# Altium project PJ1301-001-A1.PrjPCB (part 1 of 2)
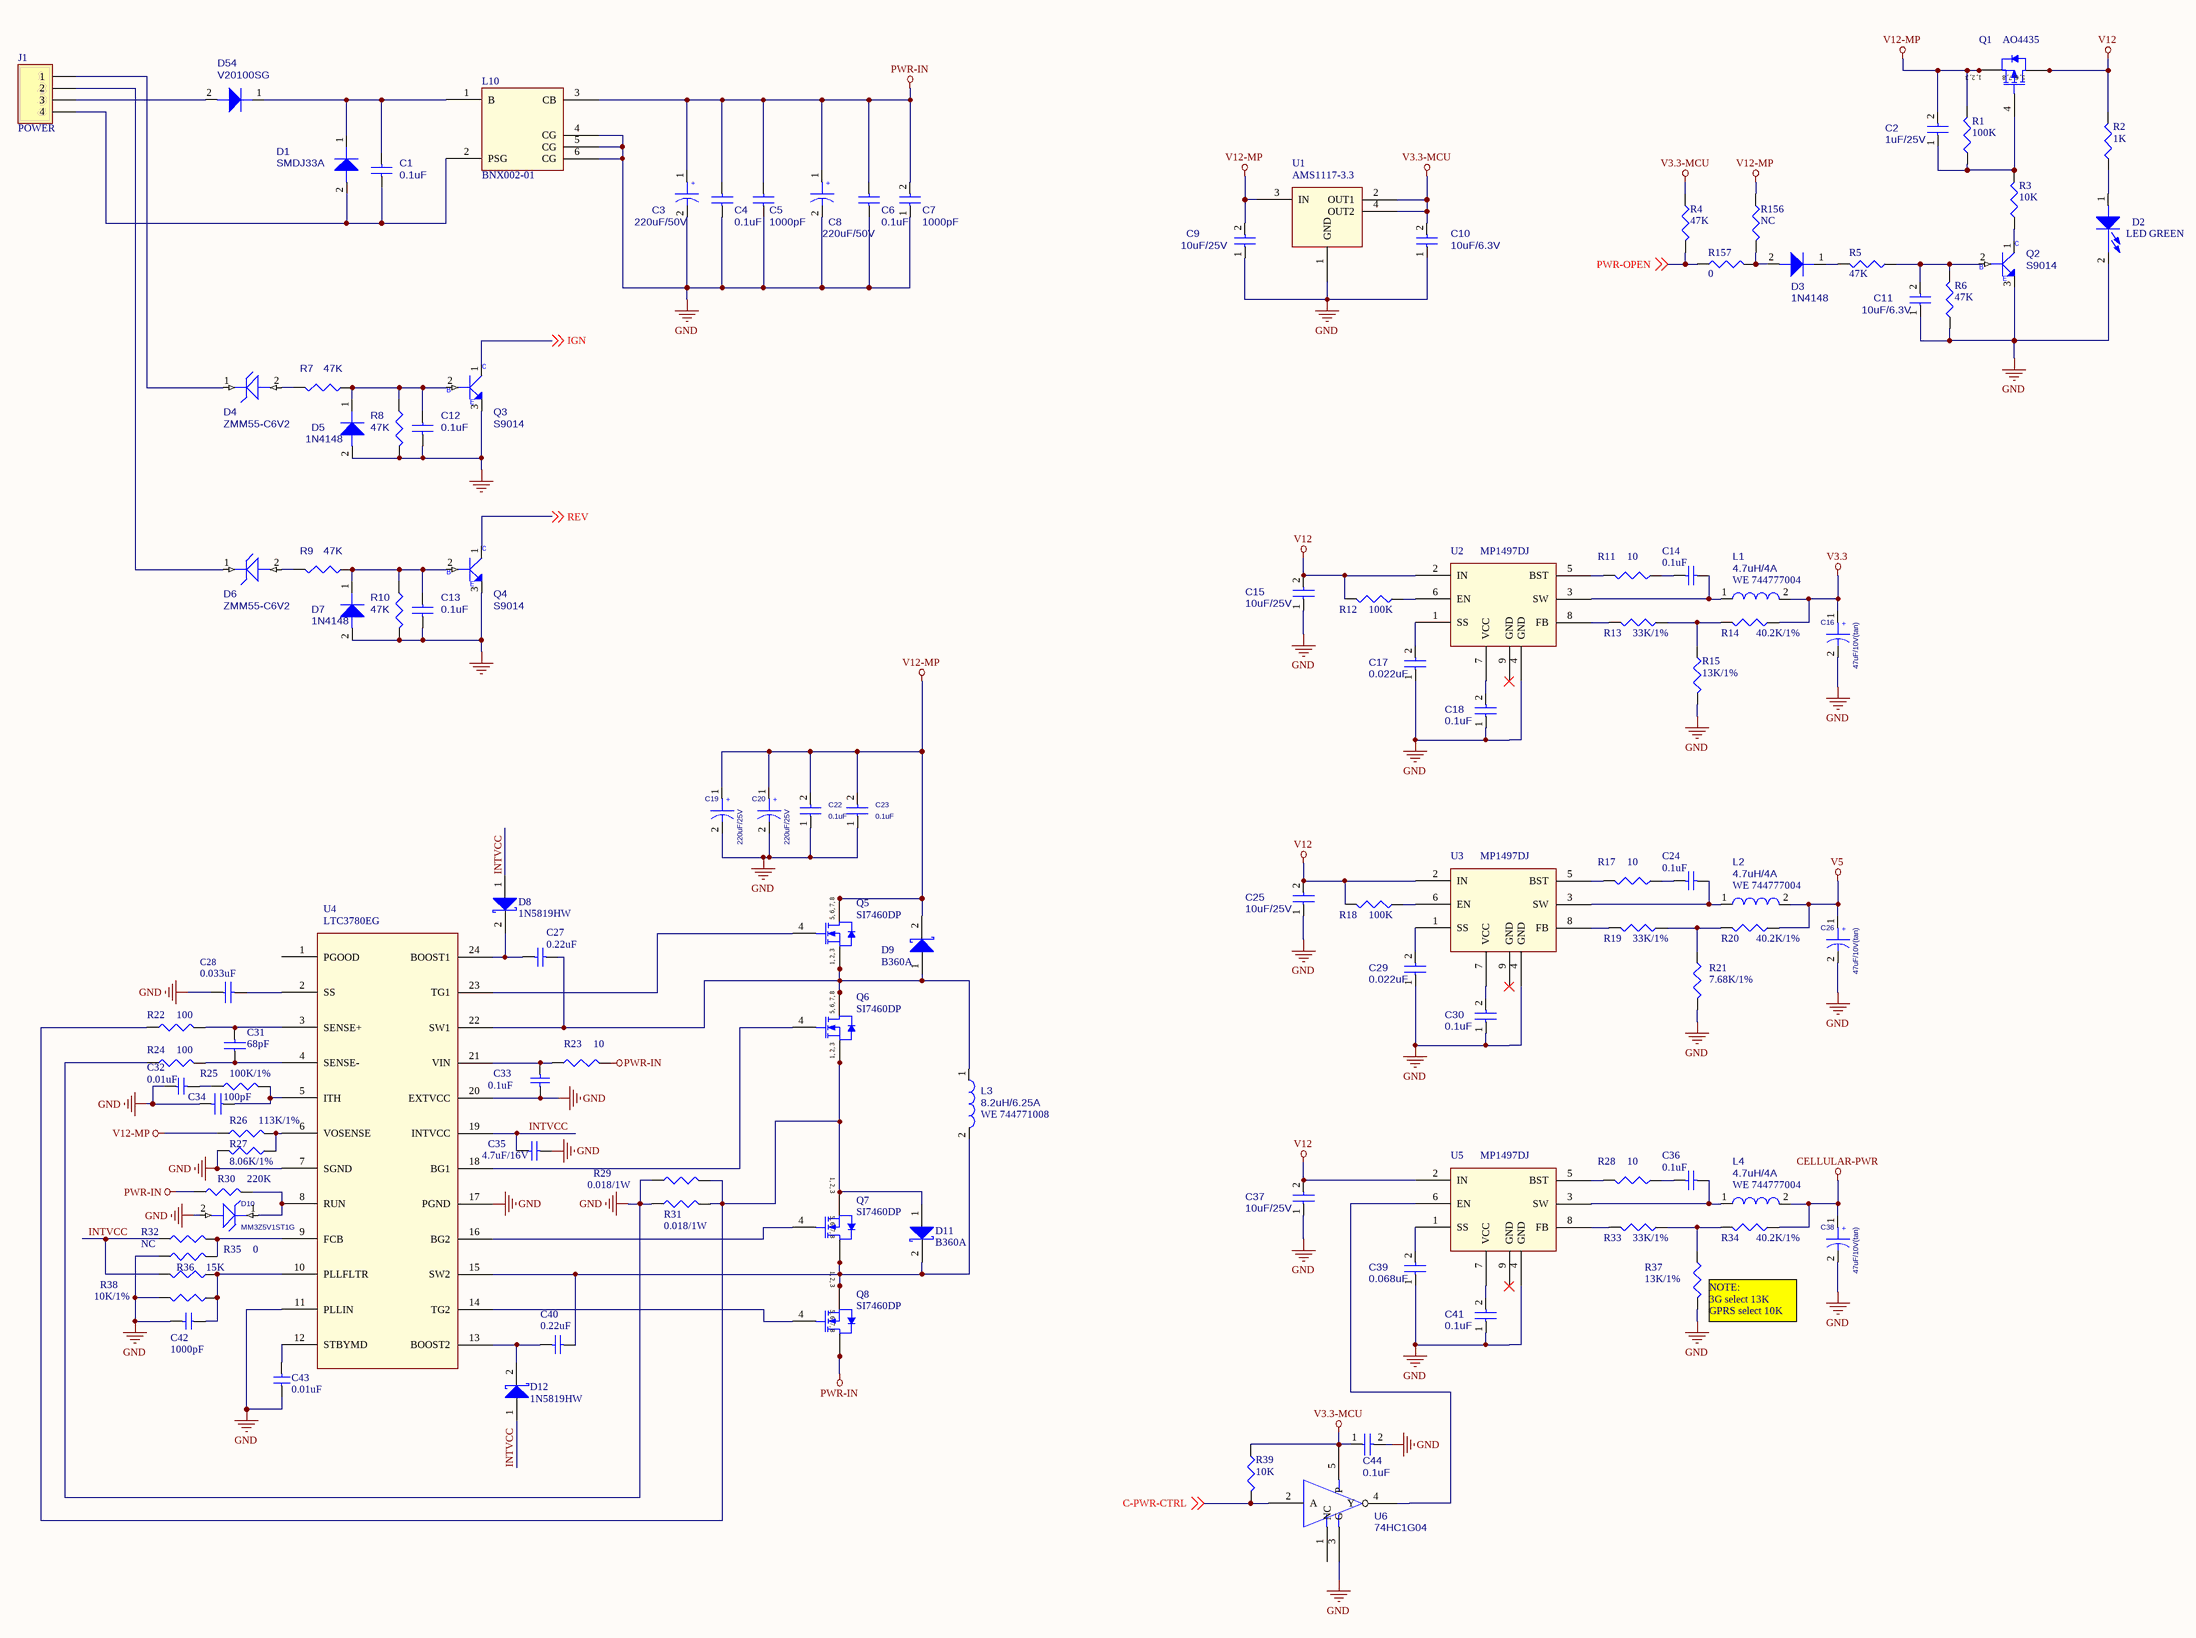
[diagram p0: [01]POWER.SchDoc]
12 sheets, 429 parts. Net scope: global (net labels, ports and power ports of the same name join across sheets).
Board file: PJ1301-001-A1.PcbDoc
Sheets:
  [01]POWER.SchDoc
  [02]MCU.SchDoc
  [03]CORE_BOARD.SchDoc
  [04]STORAGE.SchDoc
  [05]USB_HUB.SchDoc
  [06]EXT_UART.SchDoc
  [07]COMM_BOARD.SchDoc
  [08]CAN.SchDoc
  [09]SERIAL_PORT.SchDoc
  [10]MISC.SchDoc
  [11]VIDEO_PORT.SchDoc
  [12]IO_PORT.SchDoc

## Sheet [01]POWER.SchDoc
size C

### Parts
C1  0.1uF  [0603]
C2  1uF/25V  [0805]
C3  220uF/50V  [DL-10*10.5]
C4  0.1uF  [0603]
C5  1000pF  [0603]
C6  0.1uF  [0603]
C7  1000pF  [0603]
C8  220uF/50V  [DL-10*10.5]
C9  10uF/25V  [1812]
C10  10uF/6.3V  [0805]
C11  10uF/6.3V  [0805]
C12  0.1uF  [0603]
C13  0.1uF  [0603]
C14  0.1uF  [0603]
C15  10uF/25V  [1812]
C16  47uF/10V(tan)  [3528]
C17  0.022uF  [0603]
C18  0.1uF  [0603]
C19  220uF/25V  [DL-8*10.5]
C20  220uF/25V  [DL-8*10.5]
C22  0.1uF  [0603]
C23  0.1uF  [0603]
C24  0.1uF  [0603]
C25  10uF/25V  [1812]
C26  47uF/10V(tan)  [3528]
C27  0.22uF  [0603]
C28  0.033uF  [0603]
C29  0.022uF  [0603]
C30  0.1uF  [0603]
C31  68pF  [0603]
C32  0.01uF  [0603]
C33  0.1uF  [0603]
C34  100pF  [0603]
C35  4.7uF/16V  [0805]
C36  0.1uF  [0603]
C37  10uF/25V  [1812]
C38  47uF/10V(tan)  [3528]
C39  0.068uF  [0603]
C40  0.22uF  [0603]
C41  0.1uF  [0603]
C42  1000pF  [0603]
C43  0.01uF  [0603]
C44  0.1uF  [0603]
D1  SMDJ33A  [DO214AB]
D2  LED GREEN  [LED0603]
D3  1N4148  [MINI-MELF]
D4  ZMM55-C6V2  [MINI-MELF]
D5  1N4148  [MINI-MELF]
D6  ZMM55-C6V2  [MINI-MELF]
D7  1N4148  [MINI-MELF]
D8  1N5819HW  [1N5819]
D9  B360A  [B320A]
D10  MM3Z5V1ST1G  [MM3Z5V1ST1G]
D11  B360A  [B320A]
D12  1N5819HW  [1N5819]
D54  V20100SG  [V20100SG]
J1  POWER  [5557-4PIN]
L1  4.7uH/4A  code: WE 744777004  [IND-4.7UH-4A]
L2  4.7uH/4A  code: WE 744777004  [IND-4.7UH-4A]
L3  8.2uH/6.25A  code: WE 744771008  [IND-8.2UH-10A]
L4  4.7uH/4A  code: WE 744777004  [IND-4.7UH-4A]
L10  BNX002-01  [BNX002-001]
Q1  AO4435  [SO8]
Q2  S9014  [NPN]
Q3  S9014  [NPN]
Q4  S9014  [NPN]
Q5  SI7460DP  [POWERPAK]
Q6  SI7460DP  [POWERPAK]
Q7  SI7460DP  [POWERPAK]
Q8  SI7460DP  [POWERPAK]
R1  100K  [0603]
R2  1K  [0603]
R3  10K  [0603]
R4  47K  [0603]
R5  47K  [0603]
R6  47K  [0603]
R7  47K  [0603]
R8  47K  [0603]
R9  47K  [0603]
R10  47K  [0603]
R11  10  [0603]
R12  100K  [0603]
R13  33K/1%  [0603]
R14  40.2K/1%  [0603]
R15  13K/1%  [0603]
R17  10  [0603]
R18  100K  [0603]
R19  33K/1%  [0603]
R20  40.2K/1%  [0603]
R21  7.68K/1%  [0603]
R22  100  [0603]
R23  10  [0805]
R24  100  [0603]
R25  100K/1%  [0603]
R26  113K/1%  [0603]
R27  8.06K/1%  [0603]
R28  10  [0603]
R29  0.018/1W  [2512]
R30  220K  [0603]
R31  0.018/1W  [2512]
R32  NC  [0603]
R33  33K/1%  [0603]
R34  40.2K/1%  [0603]
R35  0  [0603]
R36  15K  [0603]
R37  13K/1%  [0603]
R38  10K/1%  [0603]
R39  10K  [0603]
R156  NC  [0603]
R157  0  [0603]
U1  AMS1117-3.3  [AMS1117]
U2  MP1497DJ  [TSOT23-8]
U3  MP1497DJ  [TSOT23-8]
U4  LTC3780EG  [LTC3780EG]
U5  MP1497DJ  [TSOT23-8]
U6  74HC1G04  [SOT753]

### Nets
CELLULAR-PWR: C38.1 L4.2 R34.1
GND: C3.2 C4.1 C5.1 C6.1 C7.1 C8.2 C9.1 C10.1 C11.1 C12.2 C13.2 C15.1 C16.2 C17.1 C18.1 C19.2 C20.2 C22.1 C23.1 C25.1 C26.2 C28.1 C29.1 C30.1 C32.1 C33.1 C34.2 C35.2 C37.1 C38.2 C39.1 C41.1 C42.2 C43.1 C44.2 D2.2(CATHODE) D5.2 D7.2 D10.2 L10.4(CG) L10.5(CG) L10.6(CG) Q2.3(EMITTER) Q3.3(EMITTER) Q4.3(EMITTER) R6.1 R8.2 R10.2 R15.2 R21.2 R24.1 R27.2 R29.1 R31.1 R35.1 R37.2 R38.2 U1.1(GND) U2.4(GND) U3.4(GND) U4.7(SGND) U4.11(PLLIN) U4.17(PGND) U4.20(EXTVCC) U5.4(GND) U6.3(G)
PWR-IN: C3.1 C4.2 C5.2 C6.2 C7.2 C8.1 L10.3(CB) Q8.5(D) Q8.6(D) Q8.7(D) Q8.8(D) R23.2 R30.1
V3.3: C16.1 L1.2 R14.1
V3.3-MCU: C10.2 C44.1 R4.1 R39.1 U1.2(OUT1) U1.4(OUT2) U6.5(P)
V5: C26.1 L2.2 R20.1
V12: C15.2 C25.2 C37.2 Q1.5(D) Q1.6(D) Q1.7(D) Q1.8(D) R2.2 R12.2 R18.2 U2.2(IN) U3.2(IN) U5.2(IN)
V12-MP: C2.2 C9.2 C19.1 C20.1 C22.2 C23.2 D9.2(K) Q1.1(S) Q1.2(S) Q1.3(S) Q5.5(D) Q5.6(D) Q5.7(D) Q5.8(D) R1.2 R26.1 R156.1 U1.3(IN)
C-PWR-CTRL: R39.2 U6.2(A) ; off-sheet C-PWR-CTRL
IGN: Q3.1(COLLECTOR) ; off-sheet IGN
INTVCC: C35.1 D8.1(A) D12.1(A) R32.1 R36.2 U4.19(INTVCC)
PWR-OPEN: R4.2 R157.1 ; off-sheet PWR-OPEN
REV: Q4.1(COLLECTOR) ; off-sheet REV
NetC1_1: C1.1 D1.2 J1.4 L10.2(PSG)
NetC1_2: C1.2 D1.1 D54.1 L10.1(B)
NetC2_1: C2.1 Q1.4(G) R1.1 R3.2
NetC11_2: C11.2 Q2.2(BASE) R5.1 R6.2
NetC12_1: C12.1 D5.1 Q3.2(BASE) R7.1 R8.1
NetC13_1: C13.1 D7.1 Q4.2(BASE) R9.1 R10.1
NetC14_1: C14.1 L1.1 U2.3(SW)
NetC14_2: C14.2 R11.1
NetC17_2: C17.2 U2.1(SS)
NetC18_2: C18.2 U2.7(VCC)
NetC24_1: C24.1 L2.1 U3.3(SW)
NetC24_2: C24.2 R17.1
NetC27_1: C27.1 D9.1(A) L3.1 Q5.1(S) Q5.2(S) Q5.3(S) Q6.5(D) Q6.6(D) Q6.7(D) Q6.8(D) U4.22(SW1)
NetC27_2: C27.2 D8.2(K) U4.24(BOOST1)
NetC28_2: C28.2 U4.2(SS)
NetC29_2: C29.2 U3.1(SS)
NetC30_2: C30.2 U3.7(VCC)
NetC31_1: C31.1 R24.2 U4.4(SENSE-)
NetC31_2: C31.2 R22.2 U4.3(SENSE+)
NetC32_2: C32.2 R25.1
NetC33_2: C33.2 R23.1 U4.21(VIN)
NetC34_1: C34.1 R25.2 U4.5(ITH)
NetC36_1: C36.1 L4.1 U5.3(SW)
NetC36_2: C36.2 R28.1
NetC39_2: C39.2 U5.1(SS)
NetC40_1: C40.1 D11.2(K) L3.2 Q7.5(D) Q7.6(D) Q7.7(D) Q7.8(D) Q8.1(S) Q8.2(S) Q8.3(S) U4.15(SW2)
NetC40_2: C40.2 D12.2(K) U4.13(BOOST2)
NetC41_2: C41.2 U5.7(VCC)
NetC42_1: C42.1 R36.1 R38.1 U4.10(PLLFLTR)
NetC43_2: C43.2 U4.12(STBYMD)
NetD2_1: D2.1(ANODE) R2.1
NetD3_1: D3.1 R5.2
NetD3_2: D3.2 R156.2 R157.2
NetD4_1: D4.1 J1.1
NetD4_2: D4.2 R7.2
NetD6_1: D6.1 J1.2
NetD6_2: D6.2 R9.2
NetD10_1: D10.1 R30.2 U4.8(RUN)
NetD11_1: D11.1(A) Q6.1(S) Q6.2(S) Q6.3(S) Q7.1(S) Q7.2(S) Q7.3(S) R22.1 R29.2 R31.2
NetD54_2: D54.2 J1.3
NetQ2_1: Q2.1(COLLECTOR) R3.1
NetQ5_4: Q5.4(G) U4.23(TG1)
NetQ6_4: Q6.4(G) U4.18(BG1)
NetQ7_4: Q7.4(G) U4.16(BG2)
NetQ8_4: Q8.4(G) U4.14(TG2)
NetR11_2: R11.2 U2.5(BST)
NetR12_1: R12.1 U2.6(EN)
NetR13_1: R13.1 R14.2 R15.1
NetR13_2: R13.2 U2.8(FB)
NetR17_2: R17.2 U3.5(BST)
NetR18_1: R18.1 U3.6(EN)
NetR19_1: R19.1 R20.2 R21.1
NetR19_2: R19.2 U3.8(FB)
NetR26_2: R26.2 R27.1 U4.6(VOSENSE)
NetR28_2: R28.2 U5.5(BST)
NetR32_2: R32.2 R35.2 U4.9(FCB)
NetR33_1: R33.1 R34.2 R37.1
NetR33_2: R33.2 U5.8(FB)
NetU5_6: U5.6(EN) U6.4(Y)

Not connected (* = marked no-connect by the designer): U2 9(GND)*; U3 9(GND)*; U4 1(PGOOD); U5 9(GND)*; U6 1(NC)

### Notes on the sheet
- (near R37) NOTE:
  3G select 13K
  GPRS select 10K
- (in symbol CAP WP) +
- (in symbol MMBT3904_NL_SOT23-3) C; B; E
- (in symbol SI4410DY) 1, 2, 3; 5, 6, 7, 8
- (in symbol SI4431DY) 1, 2, 3; 5, 6, 7, 8

### Library data of the parts
C1 C2 C4-C7 C9-C11 C15 C17 C18 C22 C23 C25 C29 C30 C37 C39 C41 C44 = CAP NP_Dup2
C3 C8 C16 C19 C20 C26 C38 = CAP WP
C12 C13 = CAP
C14 C24 C27 C33 C35 C36 C40 = Cap: Capacitor
C28 C31 = 06033C223KAT1A_0
C32 = 06033C103KAT2A
C34 = 06035A470KAT1A_0
C42 C43 = 06033C103KAT2A_0
D1 D3 D5 D7 D54 = 1N4148WS-7-F_SOD323-2
D2 = LN01401_1
D4 D6 D10 = MMGZ5231BPTLL34
D8 D9 D11 D12 = Diode 11DQ03: Schottky Rectifier
J1 = Header 4: Header, 4-Pin
L1-L4 = 4.7UH_CDH2D09BNP-4R7MC_0.7A_20%
Q1 = SI4431DY: P-Channel 30V (D-S)  MOSFET; Published: 8-Jun-2000; LatestRevisionDate: 13-Apr-2006; LatestRevisionNote: IPC-7351 Footprint Added.; DatasheetVersion: 6-Oct-1997; PackageVersion: Aug-1998; PackageReference: SO-8; Publisher: Altium Limited; PackageDescription: 8-Pin Small Outline Integrated Circuit 1.27 mm Pitch; ComponentLink1Description: Manufacturer Link; ComponentLink1URL: http://www.vishay.com/; ComponentLink2Description: Datasheet; ComponentLink2URL: http://www.vishay.com/docs/70151/70151.pdf
Q2 Q3 = MMBT3904_NL_SOT23-3: Part Description: S TR MMBT3904_NL NPN SOT23; Part Number: SB039040000
Q4 = MMBT3904_NL_SOT23-3
Q5-Q8 = SI4410DY: N-Channel 30V (D-S)  MOSFET
R1-R6 R11-R15 R17-R21 R23 R25 R28 R29 R31-R39 R156 R157 = CR16-1003FM
R7-R10 = R
R22 R24 = CR16-1241FM
R26 = CR16-1133FM
R27 = CR16-8061FM
R30 = CR16-224JM
U1 = LT1963EST-1_4.8
U2 U3 U5 = MP1482_5
U6 = 74LVC1G04GW_SOT353-5: Part  Number: SA00000FX00

## Sheet [02]MCU.SchDoc
size B
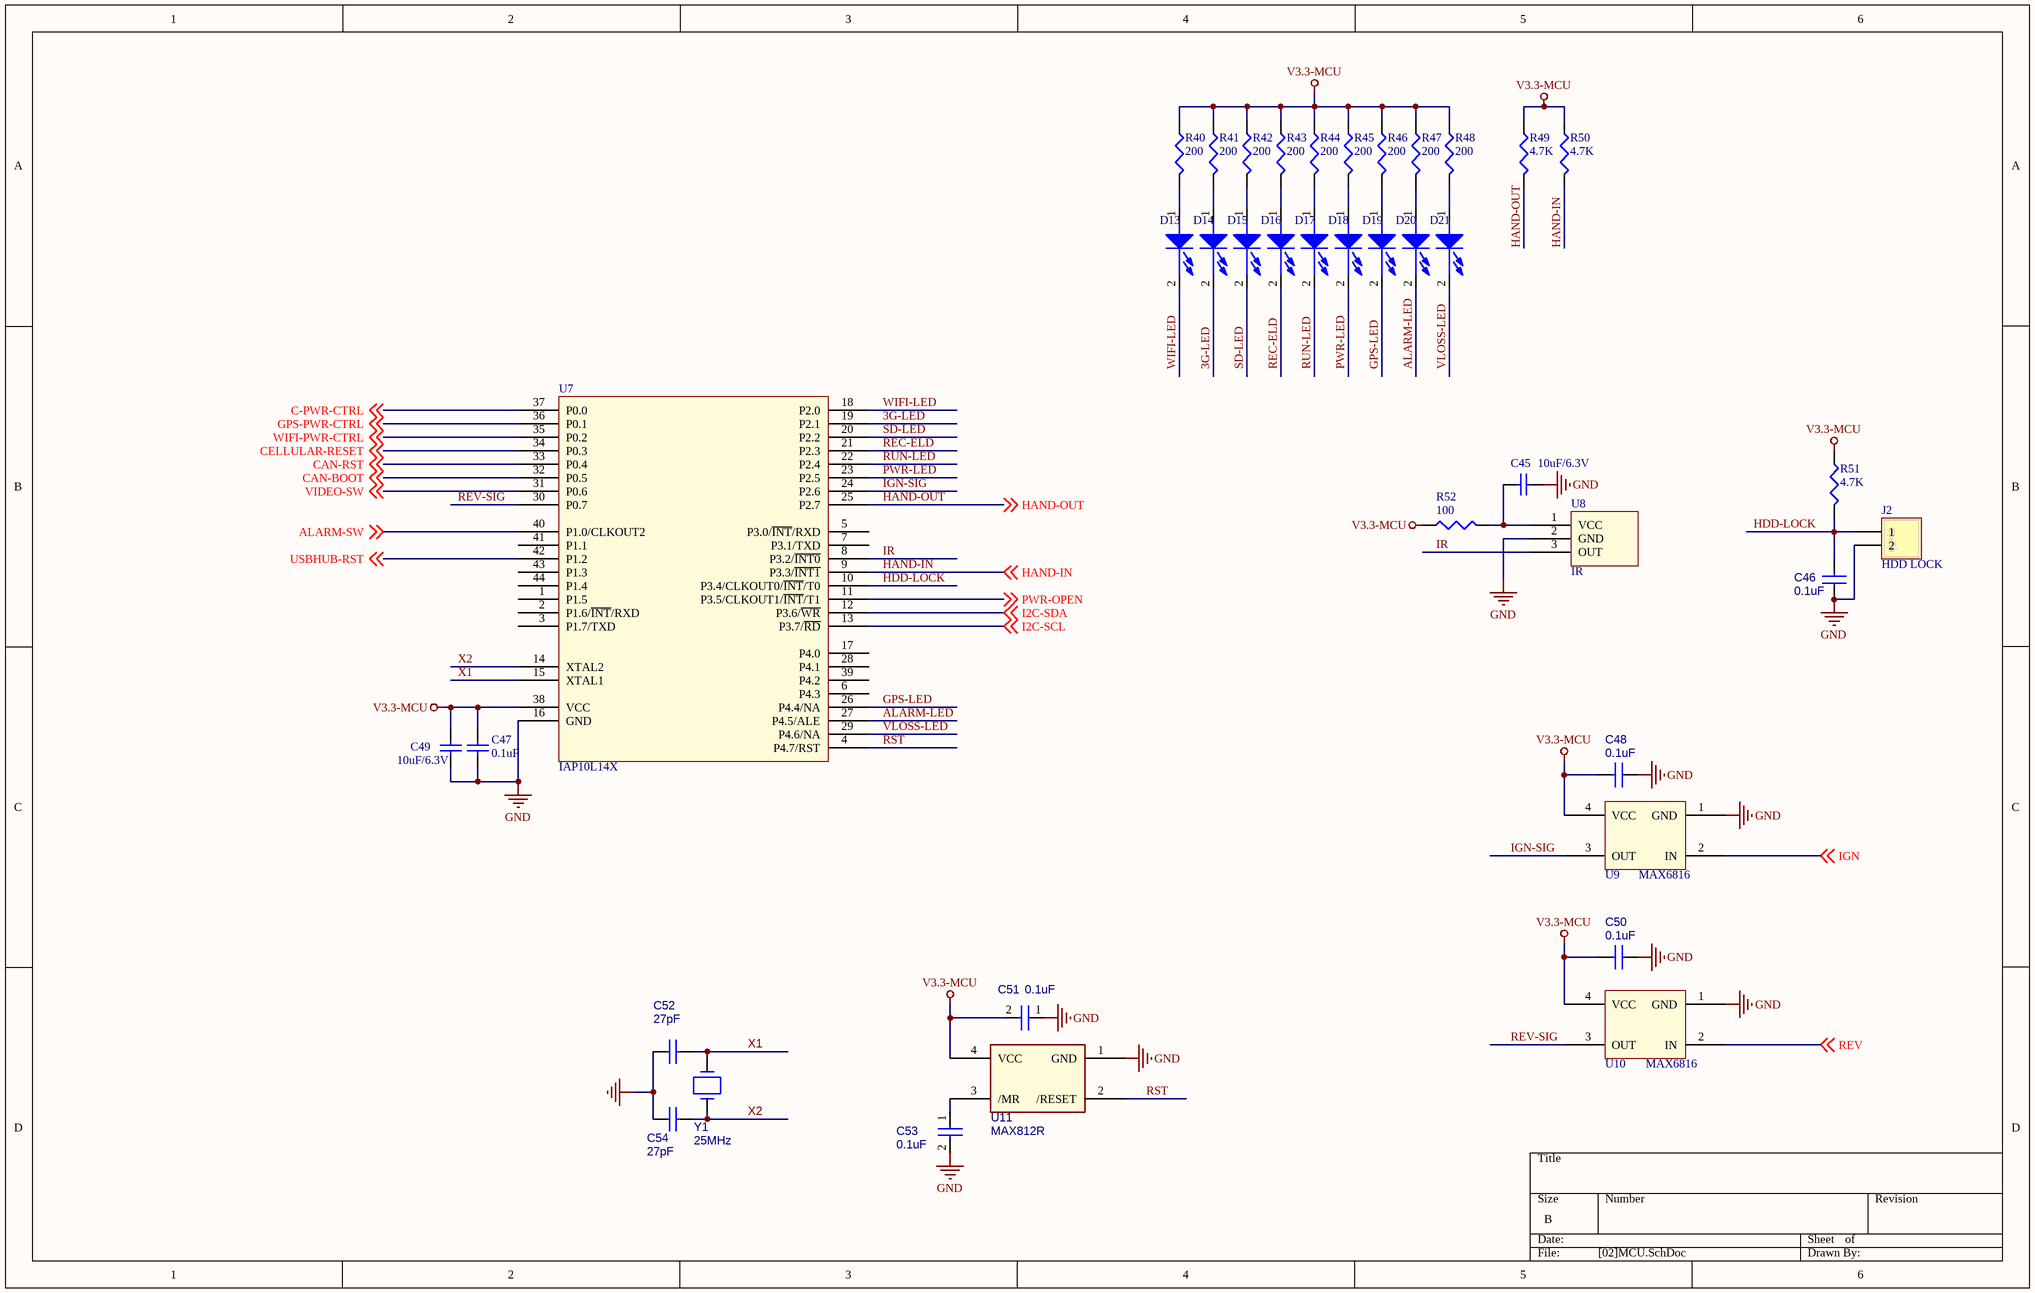
[diagram p1: [02]MCU.SchDoc]

### Parts
C45  10uF/6.3V  [0805]
C46  0.1uF  [0603]
C47  0.1uF  [0603]
C48  0.1uF  [0603]
C49  10uF/6.3V  [0805]
C50  0.1uF  [0603]
C51  0.1uF  [0603]
C52  27pF  [0603]
C53  0.1uF  [0603]
C54  27pF  [0603]
D13  LED GREEN  [LED-3MM]  (value not drawn)
D14  LED GREEN  [LED-3MM]  (value not drawn)
D15  LED GREEN  [LED-3MM]  (value not drawn)
D16  LED GREEN  [LED-3MM]  (value not drawn)
D17  LED GREEN  [LED-3MM]  (value not drawn)
D18  LED GREEN  [LED-3MM]  (value not drawn)
D19  LED GREEN  [LED-3MM]  (value not drawn)
D20  LED GREEN  [LED-3MM]  (value not drawn)
D21  LED GREEN  [LED-3MM]  (value not drawn)
J2  HDD LOCK  [CON-2PIN]
R40  200  [0603]
R41  200  [0603]
R42  200  [0603]
R43  200  [0603]
R44  200  [0603]
R45  200  [0603]
R46  200  [0603]
R47  200  [0603]
R48  200  [0603]
R49  4.7K  [0603]
R50  4.7K  [0603]
R51  4.7K  [0603]
R52  100  [0603]
U7  IAP10L14X  [LQFP44]
U8  IR  [IR]
U9  MAX6816  [SOT143]
U10  MAX6816  [SOT143]
U11  MAX812R  [SOT143]
Y1  25MHz  [XTAL_SMD]

### Nets
GND: C45.1 C46.1 C47.1 C48.1 C49.1 C50.1 C51.1 C52.1 C53.2 C54.1 J2.2 U7.16(GND) U8.2(GND) U9.1(GND) U10.1(GND) U11.1(GND)
V3.3-MCU: C47.2 C48.2 C49.2 C50.2 C51.2 R40.1 R41.1 R42.1 R43.1 R44.1 R45.1 R46.1 R47.1 R48.1 R49.1 R50.1 R51.1 R52.1 U7.38(VCC) U9.4(VCC) U10.4(VCC) U11.4(VCC)
3G-LED: D14.2(CATHODE) U7.19(P2.1)
ALARM-LED: D20.2(CATHODE) U7.27(P4.5/ALE)
ALARM-SW: U7.40(P1.0/CLKOUT2) ; off-sheet ALARM-SW
C-PWR-CTRL: U7.37(P0.0) ; off-sheet C-PWR-CTRL
CAN-BOOT: U7.32(P0.5) ; off-sheet CAN-BOOT
CAN-RST: U7.33(P0.4) ; off-sheet CAN-RST
CELLULAR-RESET: U7.34(P0.3) ; off-sheet CELLULAR-RESET
GPS-LED: D19.2(CATHODE) U7.26(P4.4/NA)
GPS-PWR-CTRL: U7.36(P0.1) ; off-sheet GPS-PWR-CTRL
HAND-IN: R50.2 U7.9(P3.3/~{INT1}) ; off-sheet HAND-IN
HAND-OUT: R49.2 U7.25(P2.7) ; off-sheet HAND-OUT
HDD-LOCK: C46.2 J2.1 R51.2 U7.10(P3.4/CLKOUT0/~{INT}/T0)
I2C-SCL: U7.13(P3.7/~{RD}) ; off-sheet I2C-SCL
I2C-SDA: U7.12(P3.6/~{WR}) ; off-sheet I2C-SDA
IGN: U9.2(IN) ; off-sheet IGN
IGN-SIG: U7.24(P2.6) U9.3(OUT)
IR: U7.8(P3.2/~{INT0}) U8.3(OUT)
PWR-LED: D18.2(CATHODE) U7.23(P2.5)
PWR-OPEN: U7.11(P3.5/CLKOUT1/~{INT}/T1) ; off-sheet PWR-OPEN
REC-ELD: D16.2(CATHODE) U7.21(P2.3)
REV: U10.2(IN) ; off-sheet REV
REV-SIG: U7.30(P0.7) U10.3(OUT)
RST: U7.4(P4.7/RST) U11.2(/RESET)
RUN-LED: D17.2(CATHODE) U7.22(P2.4)
SD-LED: D15.2(CATHODE) U7.20(P2.2)
USBHUB-RST: U7.42(P1.2) ; off-sheet USBHUB-RST
VIDEO-SW: U7.31(P0.6) ; off-sheet VIDEO-SW
VLOSS-LED: D21.2(CATHODE) U7.29(P4.6/NA)
WIFI-LED: D13.2(CATHODE) U7.18(P2.0)
WIFI-PWR-CTRL: U7.35(P0.2) ; off-sheet WIFI-PWR-CTRL
X1: C52.2 U7.15(XTAL1) Y1.2
X2: C54.2 U7.14(XTAL2) Y1.1
NetC45_2: C45.2 R52.2 U8.1(VCC)
NetC53_1: C53.1 U11.3(/MR)
NetD13_1: D13.1(ANODE) R40.2
NetD14_1: D14.1(ANODE) R41.2
NetD15_1: D15.1(ANODE) R42.2
NetD16_1: D16.1(ANODE) R43.2
NetD17_1: D17.1(ANODE) R44.2
NetD18_1: D18.1(ANODE) R45.2
NetD19_1: D19.1(ANODE) R46.2
NetD20_1: D20.1(ANODE) R47.2
NetD21_1: D21.1(ANODE) R48.2

Not connected (* = marked no-connect by the designer): U7 1(P1.5) 2(P1.6/~{INT}/RXD) 3(P1.7/TXD) 5(P3.0/~{INT}/RXD) 6(P4.3) 7(P3.1/TXD) 17(P4.0) 28(P4.1) 39(P4.2) 41(P1.1) 43(P1.3) 44(P1.4)

### Library data of the parts
C45 C47 C49 = Cap: Capacitor
C46 C48 C50 = CAP
C51 C53 = CAP NP_Dup2
C52 C54 = CAP_Dup1
D13-D21 = LN01401_1
J2 = Header 2: Header, 2-Pin; LatestRevisionDate: 17-Jul-2002; LatestRevisionNote: Re-released for DXP Platform.; Publisher: Altium Limited
R40-R52 = CR16-1003FM
U11 = MAX811
Y1 = CRYSTAL

## Sheet [03]CORE_BOARD.SchDoc
size B
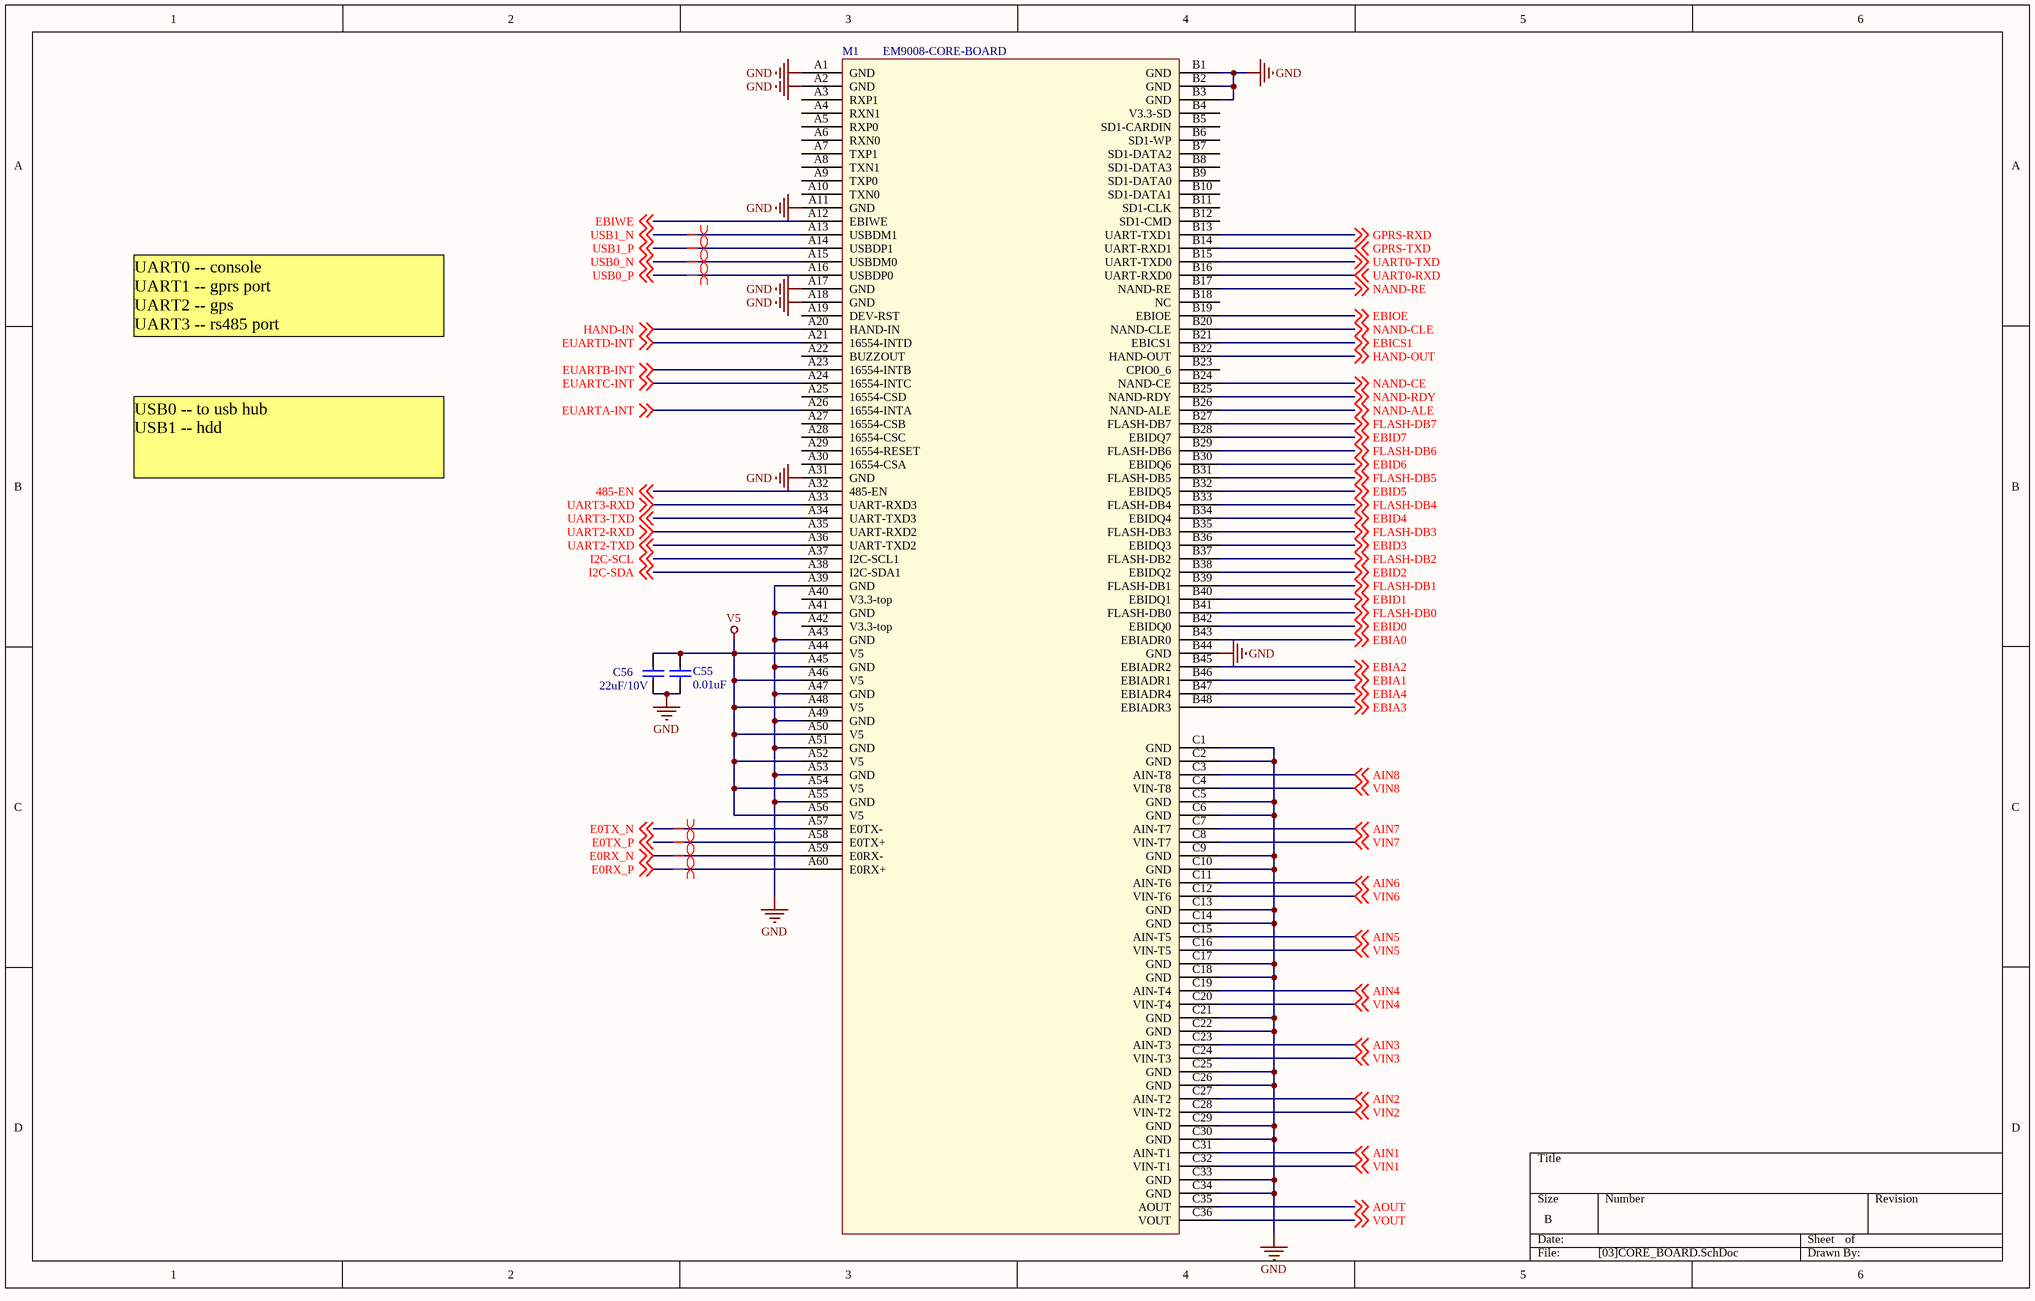
[diagram p2: [03]CORE_BOARD.SchDoc]

### Parts
C55  0.01uF  [0603]
C56  22uF/10V  [1210]
M1  EM9008-CORE-BOARD  [EM9008]

### Nets
GND: C55.1 C56.1 M1.A1(GND) M1.A2(GND) M1.A11(GND) M1.A17(GND) M1.A18(GND) M1.A31(GND) M1.A39(GND) M1.A41(GND) M1.A43(GND) M1.A45(GND) M1.A47(GND) M1.A49(GND) M1.A51(GND) M1.A53(GND) M1.A55(GND) M1.B1(GND) M1.B2(GND) M1.B3(GND) M1.B44(GND) M1.C1(GND) M1.C2(GND) M1.C5(GND) M1.C6(GND) M1.C9(GND) M1.C10(GND) M1.C13(GND) M1.C14(GND) M1.C17(GND) M1.C18(GND) M1.C21(GND) M1.C22(GND) M1.C25(GND) M1.C26(GND) M1.C29(GND) M1.C30(GND) M1.C33(GND) M1.C34(GND)
V5: C55.2 C56.2 M1.A44(V5) M1.A46(V5) M1.A48(V5) M1.A50(V5) M1.A52(V5) M1.A54(V5) M1.A56(V5)
485-EN: M1.A32(485-EN) ; off-sheet 485-EN
AIN1: M1.C31(AIN-T1) ; off-sheet AIN1
AIN2: M1.C27(AIN-T2) ; off-sheet AIN2
AIN3: M1.C23(AIN-T3) ; off-sheet AIN3
AIN4: M1.C19(AIN-T4) ; off-sheet AIN4
AIN5: M1.C15(AIN-T5) ; off-sheet AIN5
AIN6: M1.C11(AIN-T6) ; off-sheet AIN6
AIN7: M1.C7(AIN-T7) ; off-sheet AIN7
AIN8: M1.C3(AIN-T8) ; off-sheet AIN8
AOUT: M1.C35(AOUT) ; off-sheet AOUT
E0RX_N: M1.A59(E0RX-) ; off-sheet E0RX_N
E0RX_P: M1.A60(E0RX+) ; off-sheet E0RX_P
E0TX_N: M1.A57(E0TX-) ; off-sheet E0TX_N
E0TX_P: M1.A58(E0TX+) ; off-sheet E0TX_P
EBIA0: M1.B43(EBIADR0) ; off-sheet EBIA0
EBIA1: M1.B46(EBIADR1) ; off-sheet EBIA1
EBIA2: M1.B45(EBIADR2) ; off-sheet EBIA2
EBIA3: M1.B48(EBIADR3) ; off-sheet EBIA3
EBIA4: M1.B47(EBIADR4) ; off-sheet EBIA4
EBICS1: M1.B21(EBICS1) ; off-sheet EBICS1
EBID0: M1.B42(EBIDQ0) ; off-sheet EBID0
EBID1: M1.B40(EBIDQ1) ; off-sheet EBID1
EBID2: M1.B38(EBIDQ2) ; off-sheet EBID2
EBID3: M1.B36(EBIDQ3) ; off-sheet EBID3
EBID4: M1.B34(EBIDQ4) ; off-sheet EBID4
EBID5: M1.B32(EBIDQ5) ; off-sheet EBID5
EBID6: M1.B30(EBIDQ6) ; off-sheet EBID6
EBID7: M1.B28(EBIDQ7) ; off-sheet EBID7
EBIOE: M1.B19(EBIOE) ; off-sheet EBIOE
EBIWE: M1.A12(EBIWE) ; off-sheet EBIWE
EUARTA-INT: M1.A26(16554-INTA) ; off-sheet EUARTA-INT
EUARTB-INT: M1.A23(16554-INTB) ; off-sheet EUARTB-INT
EUARTC-INT: M1.A24(16554-INTC) ; off-sheet EUARTC-INT
EUARTD-INT: M1.A21(16554-INTD) ; off-sheet EUARTD-INT
FLASH-DB0: M1.B41(FLASH-DB0) ; off-sheet FLASH-DB0
FLASH-DB1: M1.B39(FLASH-DB1) ; off-sheet FLASH-DB1
FLASH-DB2: M1.B37(FLASH-DB2) ; off-sheet FLASH-DB2
FLASH-DB3: M1.B35(FLASH-DB3) ; off-sheet FLASH-DB3
FLASH-DB4: M1.B33(FLASH-DB4) ; off-sheet FLASH-DB4
FLASH-DB5: M1.B31(FLASH-DB5) ; off-sheet FLASH-DB5
FLASH-DB6: M1.B29(FLASH-DB6) ; off-sheet FLASH-DB6
FLASH-DB7: M1.B27(FLASH-DB7) ; off-sheet FLASH-DB7
GPRS-RXD: M1.B13(UART-TXD1) ; off-sheet GPRS-RXD
GPRS-TXD: M1.B14(UART-RXD1) ; off-sheet GPRS-TXD
HAND-IN: M1.A20(HAND-IN) ; off-sheet HAND-IN
HAND-OUT: M1.B22(HAND-OUT) ; off-sheet HAND-OUT
I2C-SCL: M1.A37(I2C-SCL1) ; off-sheet I2C-SCL
I2C-SDA: M1.A38(I2C-SDA1) ; off-sheet I2C-SDA
NAND-ALE: M1.B26(NAND-ALE) ; off-sheet NAND-ALE
NAND-CE: M1.B24(NAND-CE) ; off-sheet NAND-CE
NAND-CLE: M1.B20(NAND-CLE) ; off-sheet NAND-CLE
NAND-RDY: M1.B25(NAND-RDY) ; off-sheet NAND-RDY
NAND-RE: M1.B17(NAND-RE) ; off-sheet NAND-RE
UART0-RXD: M1.B16(UART-RXD0) ; off-sheet UART0-RXD
UART0-TXD: M1.B15(UART-TXD0) ; off-sheet UART0-TXD
UART2-RXD: M1.A35(UART-RXD2) ; off-sheet UART2-RXD
UART2-TXD: M1.A36(UART-TXD2) ; off-sheet UART2-TXD
UART3-RXD: M1.A33(UART-RXD3) ; off-sheet UART3-RXD
UART3-TXD: M1.A34(UART-TXD3) ; off-sheet UART3-TXD
USB0_N: M1.A15(USBDM0) ; off-sheet USB0_N
USB0_P: M1.A16(USBDP0) ; off-sheet USB0_P
USB1_N: M1.A13(USBDM1) ; off-sheet USB1_N
USB1_P: M1.A14(USBDP1) ; off-sheet USB1_P
VIN1: M1.C32(VIN-T1) ; off-sheet VIN1
VIN2: M1.C28(VIN-T2) ; off-sheet VIN2
VIN3: M1.C24(VIN-T3) ; off-sheet VIN3
VIN4: M1.C20(VIN-T4) ; off-sheet VIN4
VIN5: M1.C16(VIN-T5) ; off-sheet VIN5
VIN6: M1.C12(VIN-T6) ; off-sheet VIN6
VIN7: M1.C8(VIN-T7) ; off-sheet VIN7
VIN8: M1.C4(VIN-T8) ; off-sheet VIN8
VOUT: M1.C36(VOUT) ; off-sheet VOUT

Not connected (* = marked no-connect by the designer): M1 A3(RXP1) A4(RXN1) A5(RXP0) A6(RXN0) A7(TXP1) A8(TXN1) A9(TXP0) A10(TXN0) A19(DEV-RST) A22(BUZZOUT) A25(16554-CSD) A27(16554-CSB) A28(16554-CSC) A29(16554-RESET) A30(16554-CSA) A40(V3.3-top) A42(V3.3-top) B4(V3.3-SD) B5(SD1-CARDIN) B6(SD1-WP) B7(SD1-DATA2) B8(SD1-DATA3) B9(SD1-DATA0) B10(SD1-DATA1) B11(SD1-CLK) B12(SD1-CMD) B18(NC) B23(CPIO0_6)

### Layout directives
differential pair: E0RX_N, E0RX_P, E0TX_N, E0TX_P, USB0_N, USB0_P, USB1_N, USB1_P

### Notes on the sheet
- UART0 -- console
  UART1 -- gprs port
  UART2 -- gps
  UART3 -- rs485 port
- USB0 -- to usb hub
  USB1 -- hdd

### Library data of the parts
C55 C56 = Cap: Capacitor

## Sheet [04]STORAGE.SchDoc
size B
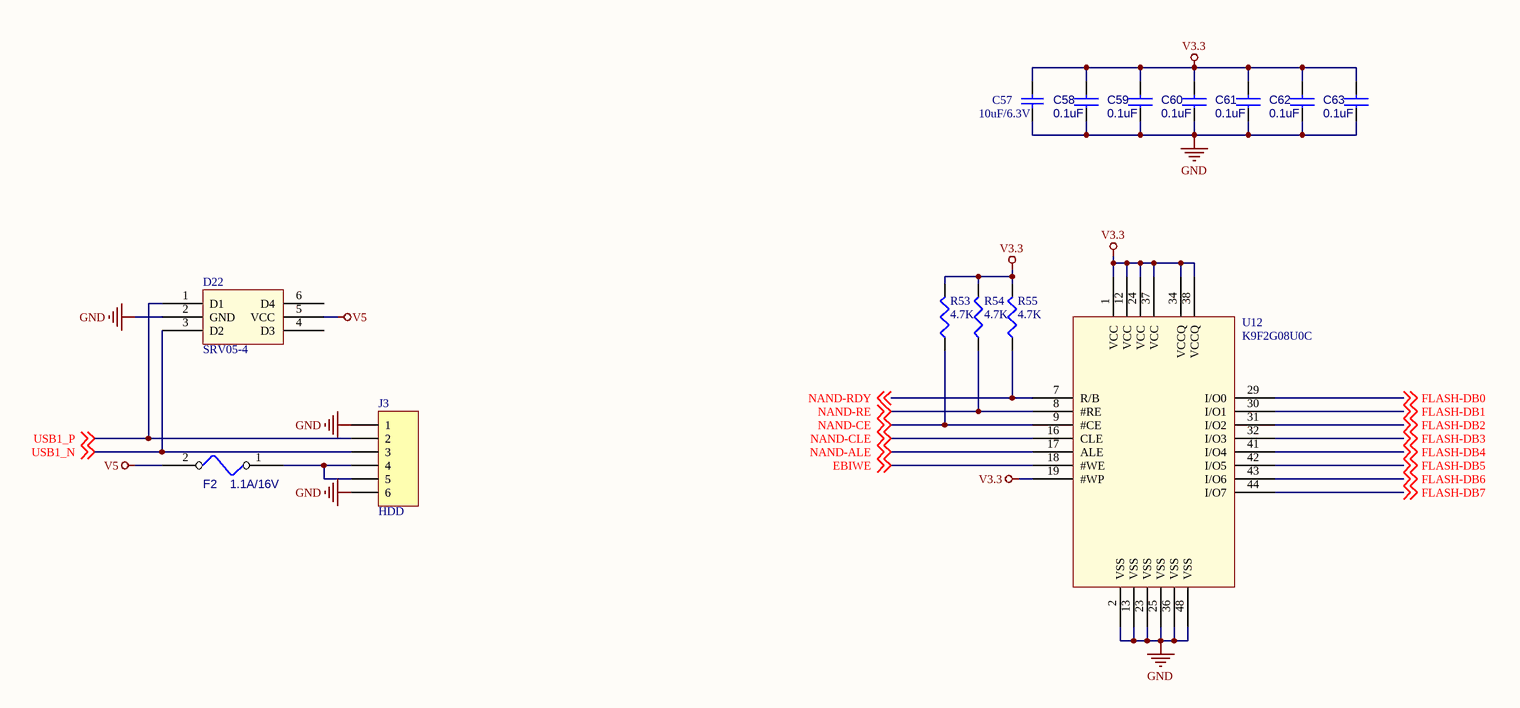
[diagram p3: [04]STORAGE.SchDoc]

### Parts
C57  10uF/6.3V  [0805]
C58  0.1uF  [0603]
C59  0.1uF  [0603]
C60  0.1uF  [0603]
C61  0.1uF  [0603]
C62  0.1uF  [0603]
C63  0.1uF  [0603]
D22  SRV05-4  [SOT23-6]
F2  1.1A/16V  [1812]
J3  HDD  [HDD-CONN]
R53  4.7K  [0603]
R54  4.7K  [0603]
R55  4.7K  [0603]
U12  K9F2G08U0C  [TSOP48]

### Nets
GND: C57.1 C58.1 C59.1 C60.1 C61.1 C62.1 C63.1 D22.2(GND) J3.1 J3.6 U12.2(VSS) U12.13(VSS) U12.23(VSS) U12.25(VSS) U12.36(VSS) U12.48(VSS)
V3.3: C57.2 C58.2 C59.2 C60.2 C61.2 C62.2 C63.2 R53.2 R54.2 R55.2 U12.1(VCC) U12.12(VCC) U12.19(#WP) U12.24(VCC) U12.34(VCCQ) U12.37(VCC) U12.38(VCCQ)
V5: D22.5(VCC) F2.2
EBIWE: U12.18(#WE) ; off-sheet EBIWE
FLASH-DB0: U12.29(I/O0) ; off-sheet FLASH-DB0
FLASH-DB1: U12.30(I/O1) ; off-sheet FLASH-DB1
FLASH-DB2: U12.31(I/O2) ; off-sheet FLASH-DB2
FLASH-DB3: U12.32(I/O3) ; off-sheet FLASH-DB3
FLASH-DB4: U12.41(I/O4) ; off-sheet FLASH-DB4
FLASH-DB5: U12.42(I/O5) ; off-sheet FLASH-DB5
FLASH-DB6: U12.43(I/O6) ; off-sheet FLASH-DB6
FLASH-DB7: U12.44(I/O7) ; off-sheet FLASH-DB7
NAND-ALE: U12.17(ALE) ; off-sheet NAND-ALE
NAND-CE: R53.1 U12.9(#CE) ; off-sheet NAND-CE
NAND-CLE: U12.16(CLE) ; off-sheet NAND-CLE
NAND-RDY: R55.1 U12.7(R/B) ; off-sheet NAND-RDY
NAND-RE: R54.1 U12.8(#RE) ; off-sheet NAND-RE
USB1_N: D22.3(D2) J3.3 ; off-sheet USB1_N
USB1_P: D22.1(D1) J3.2 ; off-sheet USB1_P
NetF2_1: F2.1 J3.4 J3.5

Not connected (* = marked no-connect by the designer): D22 4(D3) 6(D4)

### Library data of the parts
C57 = Cap: Capacitor
C58-C63 = CAP NP_Dup2
F2 = 2A_32VDC_0467-002
J3 = Header 6: Header, 6-Pin; LatestRevisionDate: 17-Jul-2002; LatestRevisionNote: Re-released for DXP Platform.; Publisher: Altium Limited
R53-R55 = Res3: Resistor
U12 = K9GBG08U0A

## Sheet [05]USB_HUB.SchDoc
size B
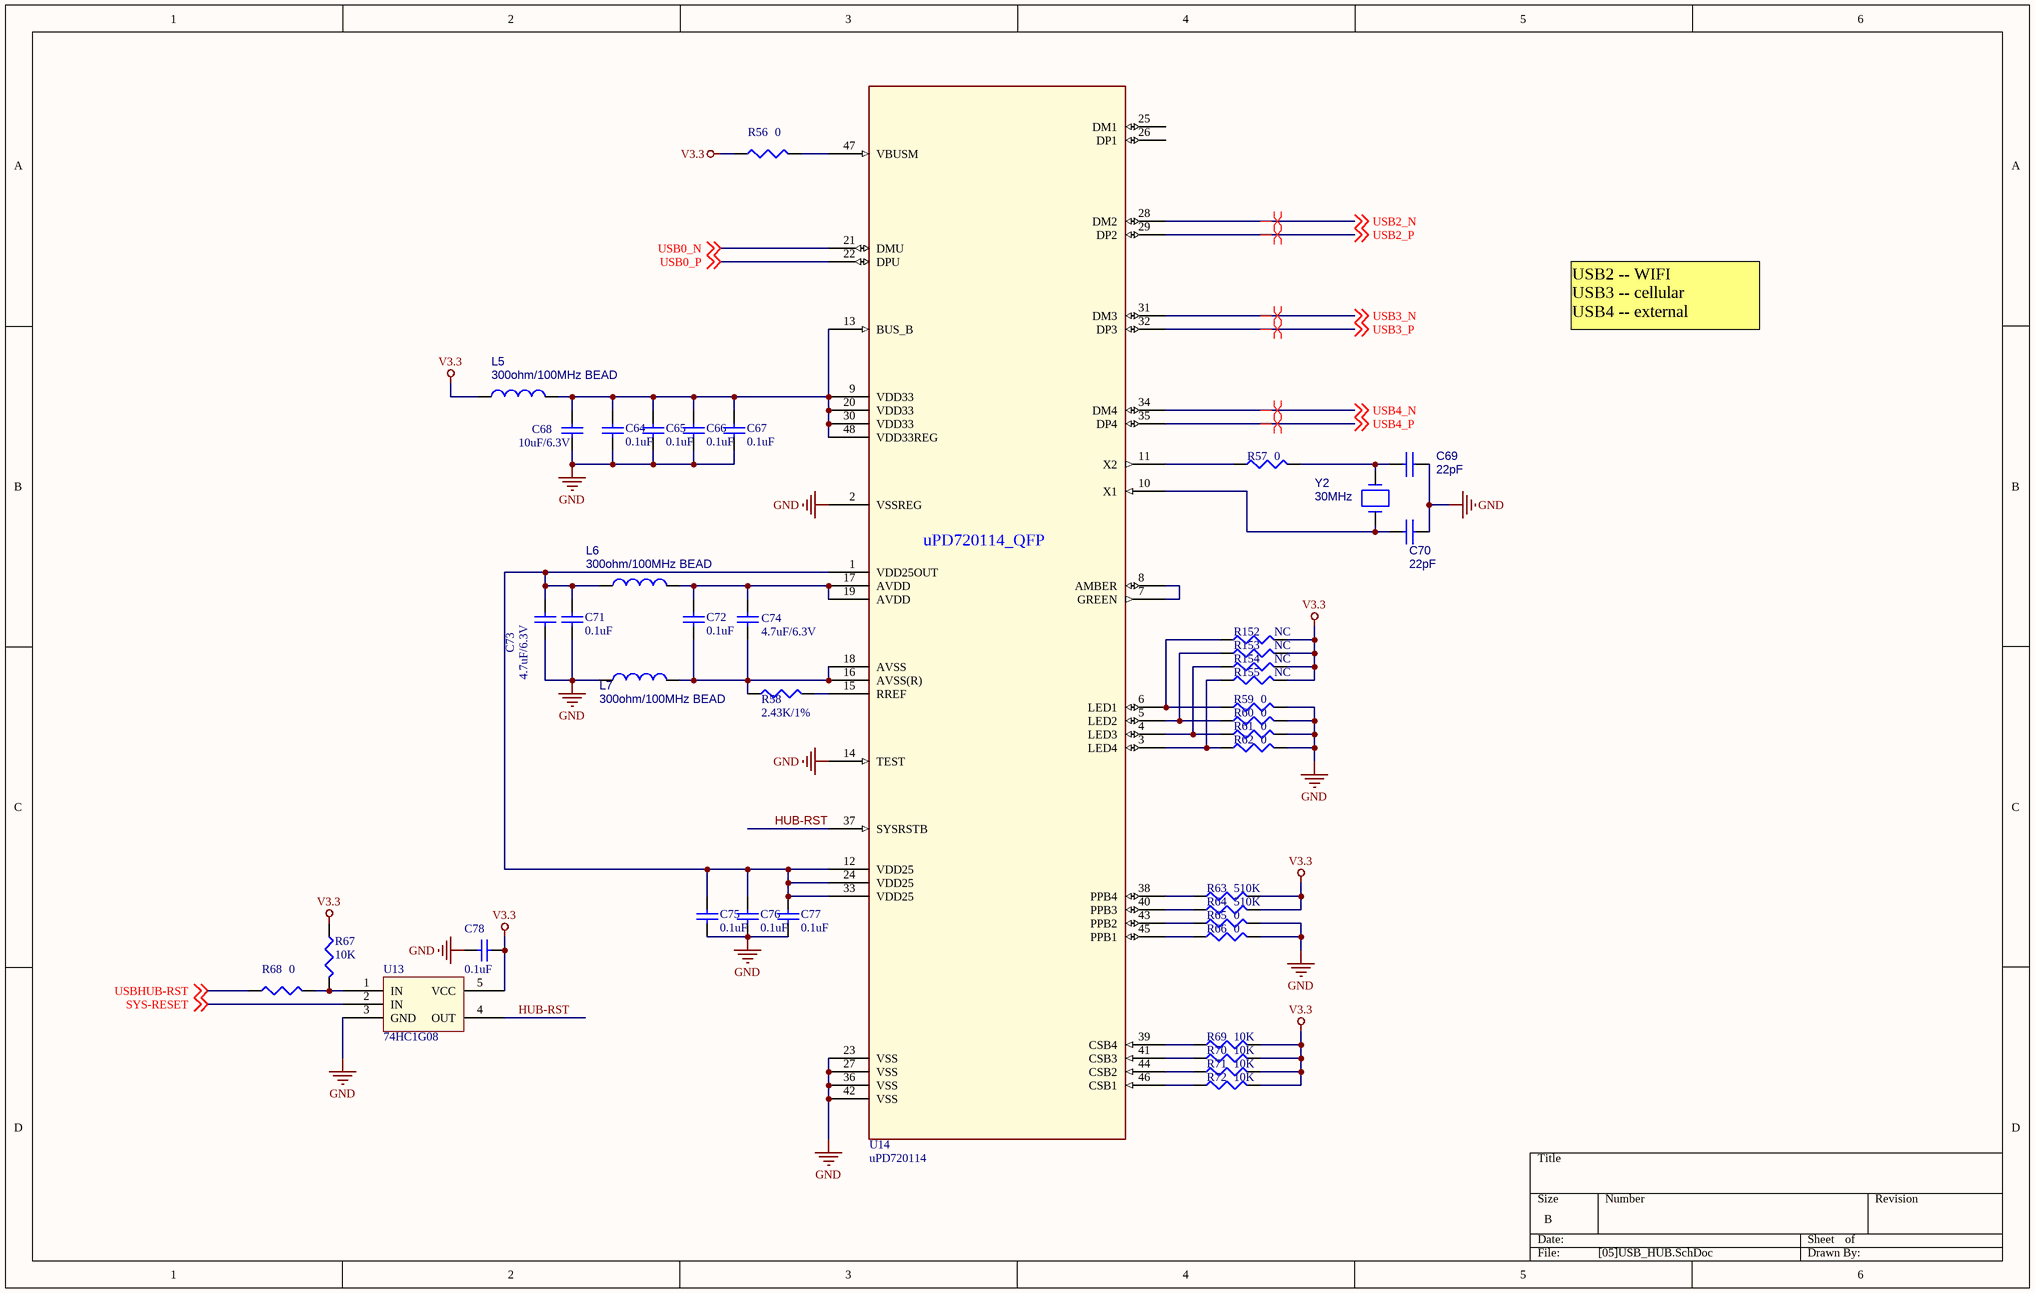
[diagram p4: [05]USB_HUB.SchDoc]

### Parts
C64  0.1uF  [0603]
C65  0.1uF  [0603]
C66  0.1uF  [0603]
C67  0.1uF  [0603]
C68  10uF/6.3V  [0805]
C69  22pF  [0603]
C70  22pF  [0603]
C71  0.1uF  [0603]
C72  0.1uF  [0603]
C73  4.7uF/6.3V  [0603]
C74  4.7uF/6.3V  [0603]
C75  0.1uF  [0603]
C76  0.1uF  [0603]
C77  0.1uF  [0603]
C78  0.1uF  [0603]
L5  300ohm/100MHz BEAD  [0603]
L6  300ohm/100MHz BEAD  [0603]
L7  300ohm/100MHz BEAD  [0603]
R56  0  [0603]
R57  0  [0603]
R58  2.43K/1%  [0603]
R59  0  [0603]
R60  0  [0603]
R61  0  [0603]
R62  0  [0603]
R63  510K  [0603]
R64  510K  [0603]
R65  0  [0603]
R66  0  [0603]
R67  10K  [0603]
R68  0  [0603]
R69  10K  [0603]
R70  10K  [0603]
R71  10K  [0603]
R72  10K  [0603]
R152  NC  [0603]
R153  NC  [0603]
R154  NC  [0603]
R155  NC  [0603]
U13  74HC1G08  [SOT23-5]
U14  uPD720114  [LQFP48]
Y2  30MHz  [XTAL_SMD]

### Nets
GND: C64.1 C65.1 C66.1 C67.1 C68.1 C69.1 C70.1 C71.1 C73.1 C75.1 C76.1 C77.1 C78.2 L7.2 R59.2 R60.2 R61.2 R62.2 R65.2 R66.2 U13.3(GND) U14.2(VSSREG) U14.14(TEST) U14.23(VSS) U14.27(VSS) U14.36(VSS) U14.42(VSS)
V3.3: C78.1 L5.2 R56.1 R63.2 R64.2 R67.1 R69.2 R70.2 R71.2 R72.2 R152.2 R153.2 R154.2 R155.2 U13.5(VCC)
HUB-RST: U13.4(OUT) U14.37(SYSRSTB)
SYS-RESET: U13.2(IN) ; off-sheet SYS-RESET
USB0_N: U14.21(DMU) ; off-sheet USB0_N
USB0_P: U14.22(DPU) ; off-sheet USB0_P
USB2_N: U14.28(DM2) ; off-sheet USB2_N
USB2_P: U14.29(DP2) ; off-sheet USB2_P
USB3_N: U14.31(DM3) ; off-sheet USB3_N
USB3_P: U14.32(DP3) ; off-sheet USB3_P
USB4_N: U14.34(DM4) ; off-sheet USB4_N
USB4_P: U14.35(DP4) ; off-sheet USB4_P
USBHUB-RST: R68.1 ; off-sheet USBHUB-RST
NetC64_2: C64.2 C65.2 C66.2 C67.2 C68.2 L5.1 U14.9(VDD33) U14.13(BUS_B) U14.20(VDD33) U14.30(VDD33) U14.48(VDD33REG)
NetC69_2: C69.2 R57.2 Y2.2
NetC70_2: C70.2 U14.10(X1) Y2.1
NetC71_2: C71.2 C73.2 C75.2 C76.2 C77.2 L6.2 U14.1(VDD25OUT) U14.12(VDD25) U14.24(VDD25) U14.33(VDD25)
NetC72_1: C72.1 C74.1 L7.1 R58.1 U14.16(AVSS(R)) U14.18(AVSS)
NetC72_2: C72.2 C74.2 L6.1 U14.17(AVDD) U14.19(AVDD)
NetR56_2: R56.2 U14.47(VBUSM)
NetR57_1: R57.1 U14.11(X2)
NetR58_2: R58.2 U14.15(RREF)
NetR59_1: R59.1 R152.1 U14.6(LED1)
NetR60_1: R60.1 R153.1 U14.5(LED2)
NetR61_1: R61.1 R154.1 U14.4(LED3)
NetR62_1: R62.1 R155.1 U14.3(LED4)
NetR63_1: R63.1 U14.38(PPB4)
NetR64_1: R64.1 U14.40(PPB3)
NetR65_1: R65.1 U14.43(PPB2)
NetR66_1: R66.1 U14.45(PPB1)
NetR67_2: R67.2 R68.2 U13.1(IN)
NetR69_1: R69.1 U14.39(CSB4)
NetR70_1: R70.1 U14.41(CSB3)
NetR71_1: R71.1 U14.44(CSB2)
NetR72_1: R72.1 U14.46(CSB1)
NetU14_7: U14.7(GREEN) U14.8(AMBER)

Not connected (* = marked no-connect by the designer): U14 25(DM1) 26(DP1)

### Layout directives
differential pair: USB2_N, USB2_P, USB3_N, USB3_P, USB4_N, USB4_P

### Notes on the sheet
- USB2 -- WIFI
  USB3 -- cellular
  USB4 -- external
- (in symbol upd720114_QFP_4) uPD720114_QFP

### Library data of the parts
C64-C68 C71-C78 = Cap: Capacitor
C69 C70 = CAP_Dup1
L5-L7 = INDUCTOR_4
R56-R72 R152-R155 = Res3: Resistor
U14 = upd720114_QFP_4
Y2 = CRYSTAL

## Sheet [06]EXT_UART.SchDoc
size B
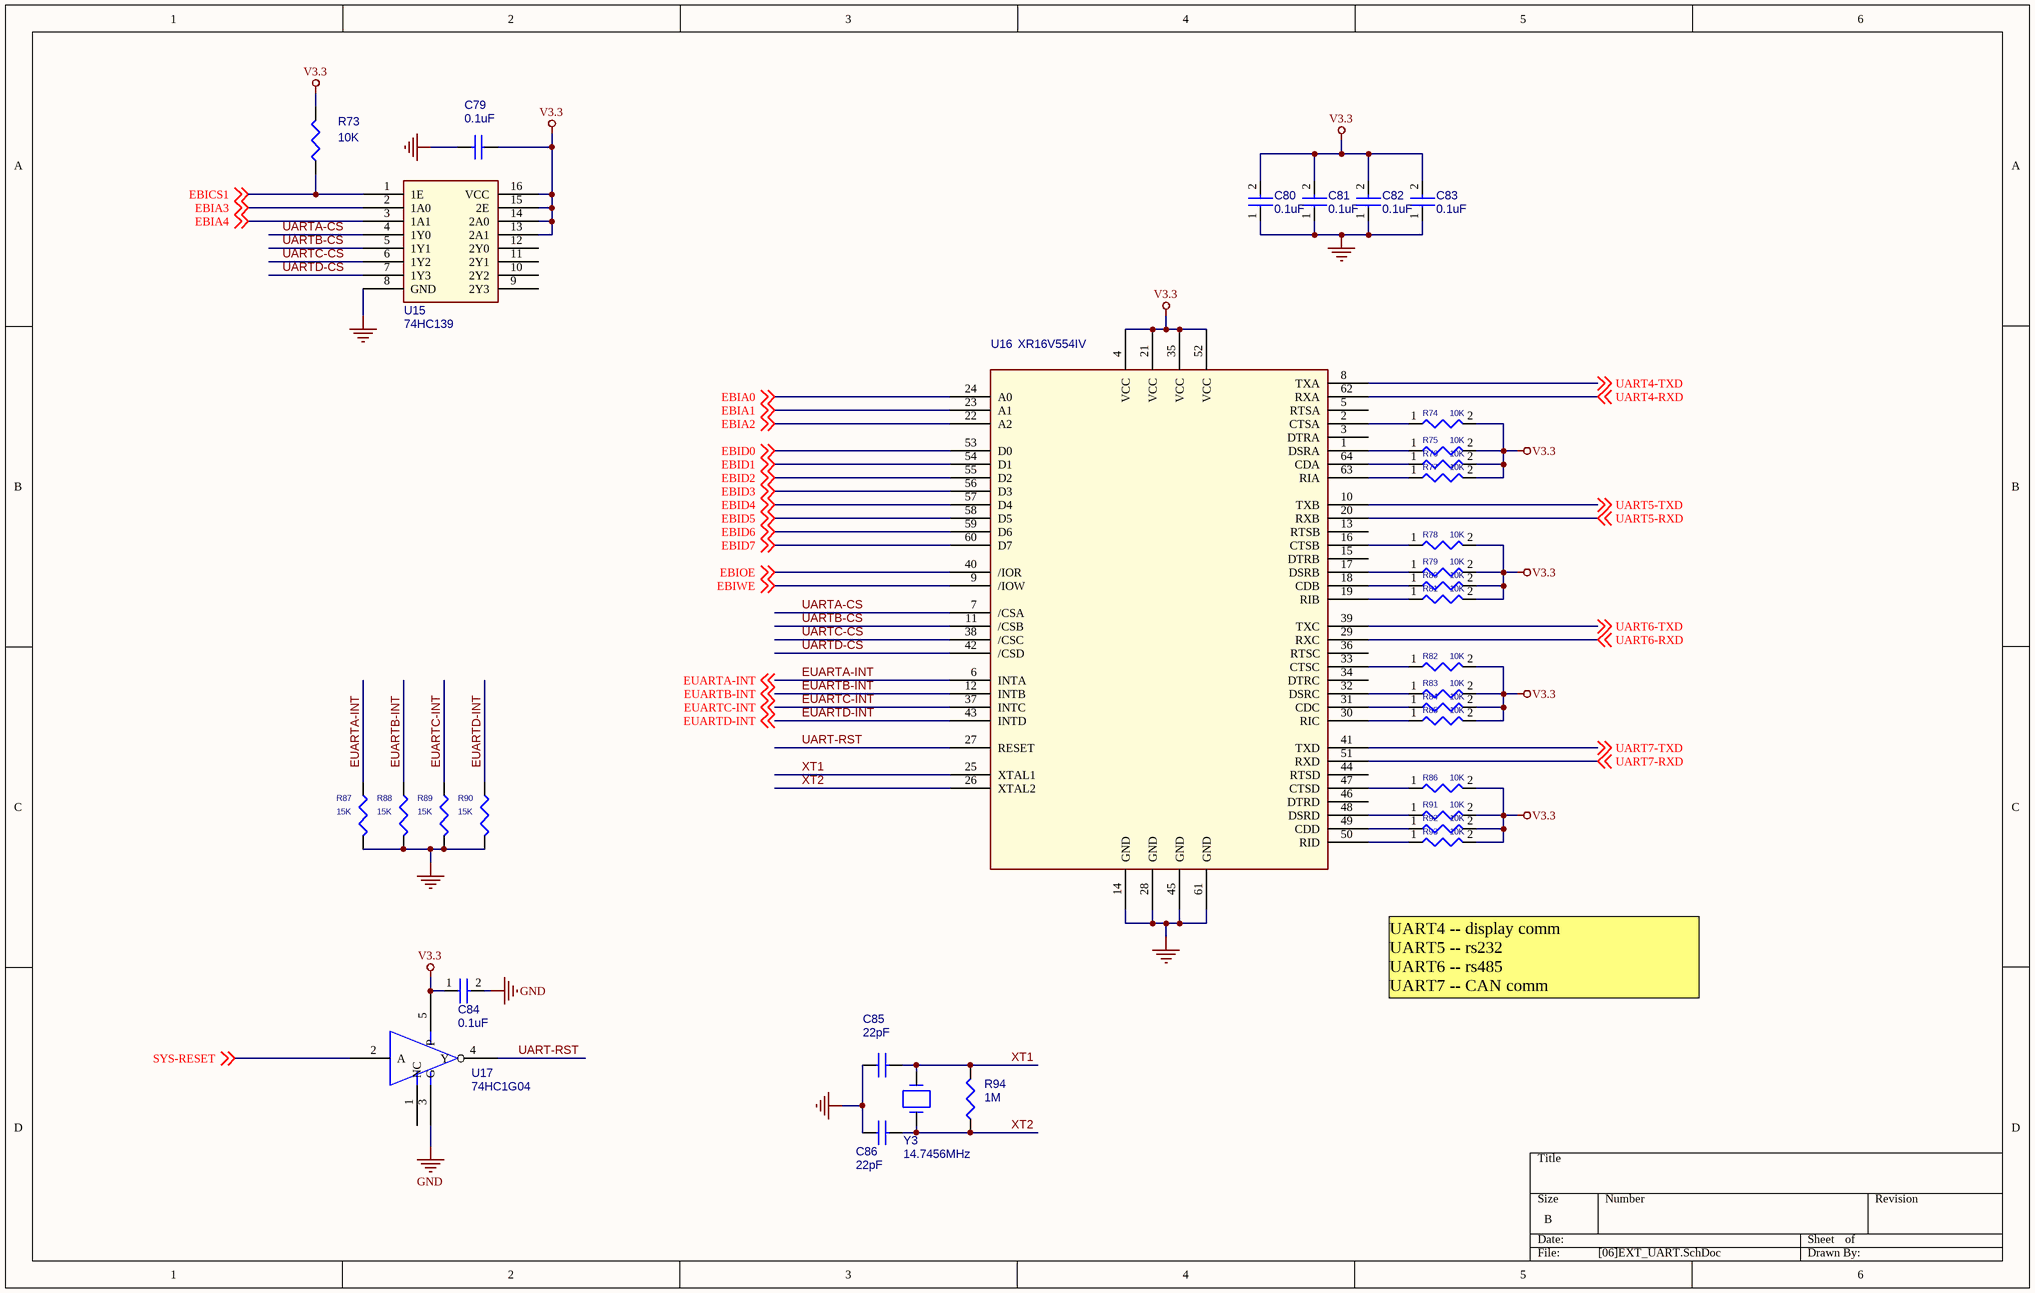
[diagram p5: [06]EXT_UART.SchDoc]

### Parts
C79  0.1uF  [0603]
C80  0.1uF  [0603]
C81  0.1uF  [0603]
C82  0.1uF  [0603]
C83  0.1uF  [0603]
C84  0.1uF  [0603]
C85  22pF  [0603]
C86  22pF  [0603]
R73  10K  [0603]
R74  10K  [0603]
R75  10K  [0603]
R76  10K  [0603]
R77  10K  [0603]
R78  10K  [0603]
R79  10K  [0603]
R80  10K  [0603]
R81  10K  [0603]
R82  10K  [0603]
R83  10K  [0603]
R84  10K  [0603]
R85  10K  [0603]
R86  10K  [0603]
R87  15K  [0603]
R88  15K  [0603]
R89  15K  [0603]
R90  15K  [0603]
R91  10K  [0603]
R92  10K  [0603]
R93  10K  [0603]
R94  1M  [0603]
U15  74HC139  [SO-16]
U16  XR16V554IV  [LQFP64]
U17  74HC1G04  [SOT753]
Y3  14.7456MHz  [XTAL_SMD]

### Nets
GND: C79.2 C80.1 C81.1 C82.1 C83.1 C84.2 C85.1 C86.1 R87.2 R88.2 R89.2 R90.2 U15.8(GND) U16.14(GND) U16.28(GND) U16.45(GND) U16.61(GND) U17.3(G)
V3.3: C79.1 C80.2 C81.2 C82.2 C83.2 C84.1 R73.2 R74.2 R75.2 R76.2 R77.2 R78.2 R79.2 R80.2 R81.2 R82.2 R83.2 R84.2 R85.2 R86.2 R91.2 R92.2 R93.2 U15.13(2A1) U15.14(2A0) U15.15(2E) U15.16(VCC) U16.4(VCC) U16.21(VCC) U16.35(VCC) U16.52(VCC) U17.5(P)
EBIA0: U16.24(A0) ; off-sheet EBIA0
EBIA1: U16.23(A1) ; off-sheet EBIA1
EBIA2: U16.22(A2) ; off-sheet EBIA2
EBIA3: U15.2(1A0) ; off-sheet EBIA3
EBIA4: U15.3(1A1) ; off-sheet EBIA4
EBICS1: R73.1 U15.1(1E) ; off-sheet EBICS1
EBID0: U16.53(D0) ; off-sheet EBID0
EBID1: U16.54(D1) ; off-sheet EBID1
EBID2: U16.55(D2) ; off-sheet EBID2
EBID3: U16.56(D3) ; off-sheet EBID3
EBID4: U16.57(D4) ; off-sheet EBID4
EBID5: U16.58(D5) ; off-sheet EBID5
EBID6: U16.59(D6) ; off-sheet EBID6
EBID7: U16.60(D7) ; off-sheet EBID7
EBIOE: U16.40(/IOR) ; off-sheet EBIOE
EBIWE: U16.9(/IOW) ; off-sheet EBIWE
EUARTA-INT: R87.1 U16.6(INTA) ; off-sheet EUARTA-INT
EUARTB-INT: R88.1 U16.12(INTB) ; off-sheet EUARTB-INT
EUARTC-INT: R89.1 U16.37(INTC) ; off-sheet EUARTC-INT
EUARTD-INT: R90.1 U16.43(INTD) ; off-sheet EUARTD-INT
SYS-RESET: U17.2(A) ; off-sheet SYS-RESET
UART4-RXD: U16.62(RXA) ; off-sheet UART4-RXD
UART4-TXD: U16.8(TXA) ; off-sheet UART4-TXD
UART5-RXD: U16.20(RXB) ; off-sheet UART5-RXD
UART5-TXD: U16.10(TXB) ; off-sheet UART5-TXD
UART6-RXD: U16.29(RXC) ; off-sheet UART6-RXD
UART6-TXD: U16.39(TXC) ; off-sheet UART6-TXD
UART7-RXD: U16.51(RXD) ; off-sheet UART7-RXD
UART7-TXD: U16.41(TXD) ; off-sheet UART7-TXD
UART-RST: U16.27(RESET) U17.4(Y)
UARTA-CS: U15.4(1Y0) U16.7(/CSA)
UARTB-CS: U15.5(1Y1) U16.11(/CSB)
UARTC-CS: U15.6(1Y2) U16.38(/CSC)
UARTD-CS: U15.7(1Y3) U16.42(/CSD)
XT1: C85.2 R94.2 U16.25(XTAL1) Y3.2
XT2: C86.2 R94.1 U16.26(XTAL2) Y3.1
NetR74_1: R74.1 U16.2(CTSA)
NetR75_1: R75.1 U16.1(DSRA)
NetR76_1: R76.1 U16.64(CDA)
NetR77_1: R77.1 U16.63(RIA)
NetR78_1: R78.1 U16.16(CTSB)
NetR79_1: R79.1 U16.17(DSRB)
NetR80_1: R80.1 U16.18(CDB)
NetR81_1: R81.1 U16.19(RIB)
NetR82_1: R82.1 U16.33(CTSC)
NetR83_1: R83.1 U16.32(DSRC)
NetR84_1: R84.1 U16.31(CDC)
NetR85_1: R85.1 U16.30(RIC)
NetR86_1: R86.1 U16.47(CTSD)
NetR91_1: R91.1 U16.48(DSRD)
NetR92_1: R92.1 U16.49(CDD)
NetR93_1: R93.1 U16.50(RID)

Not connected (* = marked no-connect by the designer): U15 9(2Y3) 10(2Y2) 11(2Y1) 12(2Y0); U16 3(DTRA) 5(RTSA) 13(RTSB) 15(DTRB) 34(DTRC) 36(RTSC) 44(RTSD) 46(DTRD); U17 1(NC)

### Notes on the sheet
- UART4 -- display comm
  UART5 -- rs232
  UART6 -- rs485
  UART7 -- CAN comm

### Library data of the parts
C79-C84 = CAP NP_Dup2
C85 C86 = CAP_Dup1
R73-R93 = R_Dup1
R94 = RESISTOR
U16 = XR16V554IV_4
U17 = 74LVC1G04GW_SOT353-5: Part  Number: SA00000FX00
Y3 = CRYSTAL

## Sheet [07]COMM_BOARD.SchDoc
size A4
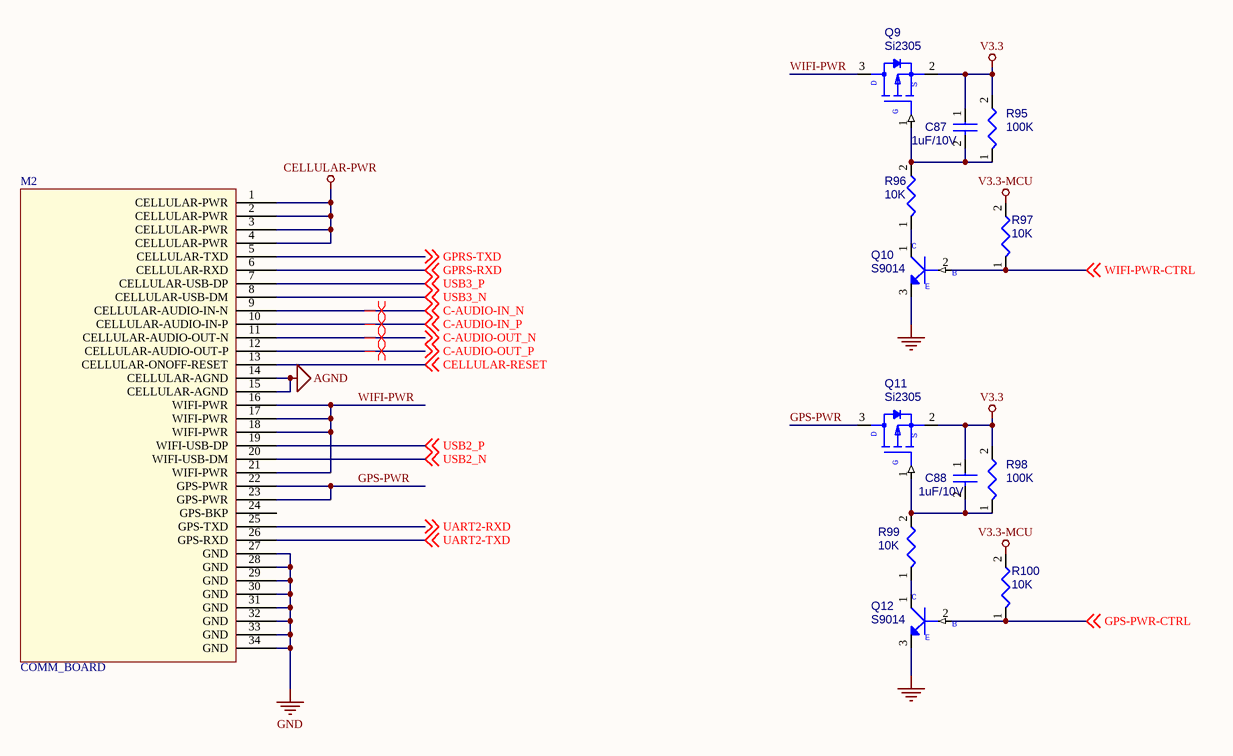
[diagram p6: [07]COMM_BOARD.SchDoc]

### Parts
C87  1uF/10V  [0603]
C88  1uF/10V  [0603]
M2  COMM_BOARD
Q9  Si2305  [MOSFET]
Q10  S9014  [NPN]
Q11  Si2305  [MOSFET]
Q12  S9014  [NPN]
R95  100K  [0603]
R96  10K  [0603]
R97  10K  [0603]
R98  100K  [0603]
R99  10K  [0603]
R100  10K  [0603]

### Nets
AGND: M2.14(CELLULAR-AGND) M2.15(CELLULAR-AGND)
CELLULAR-PWR: M2.1(CELLULAR-PWR) M2.2(CELLULAR-PWR) M2.3(CELLULAR-PWR) M2.4(CELLULAR-PWR)
GND: M2.27(GND) M2.28(GND) M2.29(GND) M2.30(GND) M2.31(GND) M2.32(GND) M2.33(GND) M2.34(GND) Q10.3(EMITTER) Q12.3(EMITTER)
V3.3: C87.1 C88.1 Q9.2(S) Q11.2(S) R95.2 R98.2
V3.3-MCU: R97.2 R100.2
C-AUDIO-IN_N: M2.9(CELLULAR-AUDIO-IN-N) ; off-sheet C-AUDIO-IN_N
C-AUDIO-IN_P: M2.10(CELLULAR-AUDIO-IN-P) ; off-sheet C-AUDIO-IN_P
C-AUDIO-OUT_N: M2.11(CELLULAR-AUDIO-OUT-N) ; off-sheet C-AUDIO-OUT_N
C-AUDIO-OUT_P: M2.12(CELLULAR-AUDIO-OUT-P) ; off-sheet C-AUDIO-OUT_P
CELLULAR-RESET: M2.13(CELLULAR-ONOFF-RESET) ; off-sheet CELLULAR-RESET
GPRS-RXD: M2.6(CELLULAR-RXD) ; off-sheet GPRS-RXD
GPRS-TXD: M2.5(CELLULAR-TXD) ; off-sheet GPRS-TXD
GPS-PWR: M2.22(GPS-PWR) M2.23(GPS-PWR) Q11.3(D)
GPS-PWR-CTRL: Q12.2(BASE) R100.1 ; off-sheet GPS-PWR-CTRL
UART2-RXD: M2.25(GPS-TXD) ; off-sheet UART2-RXD
UART2-TXD: M2.26(GPS-RXD) ; off-sheet UART2-TXD
USB2_N: M2.20(WIFI-USB-DM) ; off-sheet USB2_N
USB2_P: M2.19(WIFI-USB-DP) ; off-sheet USB2_P
USB3_N: M2.8(CELLULAR-USB-DM) ; off-sheet USB3_N
USB3_P: M2.7(CELLULAR-USB-DP) ; off-sheet USB3_P
WIFI-PWR: M2.16(WIFI-PWR) M2.17(WIFI-PWR) M2.18(WIFI-PWR) M2.21(WIFI-PWR) Q9.3(D)
WIFI-PWR-CTRL: Q10.2(BASE) R97.1 ; off-sheet WIFI-PWR-CTRL
NetC87_2: C87.2 Q9.1(G) R95.1 R96.2
NetC88_2: C88.2 Q11.1(G) R98.1 R99.2
NetQ10_1: Q10.1(COLLECTOR) R96.1
NetQ12_1: Q12.1(COLLECTOR) R99.1

Not connected (* = marked no-connect by the designer): M2 24(GPS-BKP)

### Layout directives
differential pair: C-AUDIO-IN_N, C-AUDIO-IN_P, C-AUDIO-OUT_N, C-AUDIO-OUT_P

### Notes on the sheet
- (in symbol MMBT3904_NL_SOT23-3) C; B; E

### Library data of the parts
C87 C88 = P_CAP NP
Q9 Q11 = AO3401L_SOT23-3_0: Part Number: SB934010010; ROOM: USB POWER; Part Value: AO3401L_SOT23-3
Q10 Q12 = MMBT3904_NL_SOT23-3: as Q2 on sheet [01]POWER
R95 R96 R98 R99 = P_R: Part Number: SD013100A8L; OEM Part Number: F9; Manufacturer Part number: null; Part Description: S RES 1/10W 10 +-5% 0603; Ecology: YES; Function Field: 31.2; AP: NA; ROOM: GPS; Lead Free: MY; Part Type: RESISTOR; AP Sheet: http://ISPDPRD/Windchill/servlet/WindchillAuthGW/wt.enterprise.URLProcessor/URLTemplateAction?u8&oid=VR%3Aext.compal.part.CompalPart%3A365727415&action=ObjProps
R97 R100 = R_Dup1

## Sheet [08]CAN.SchDoc
size B
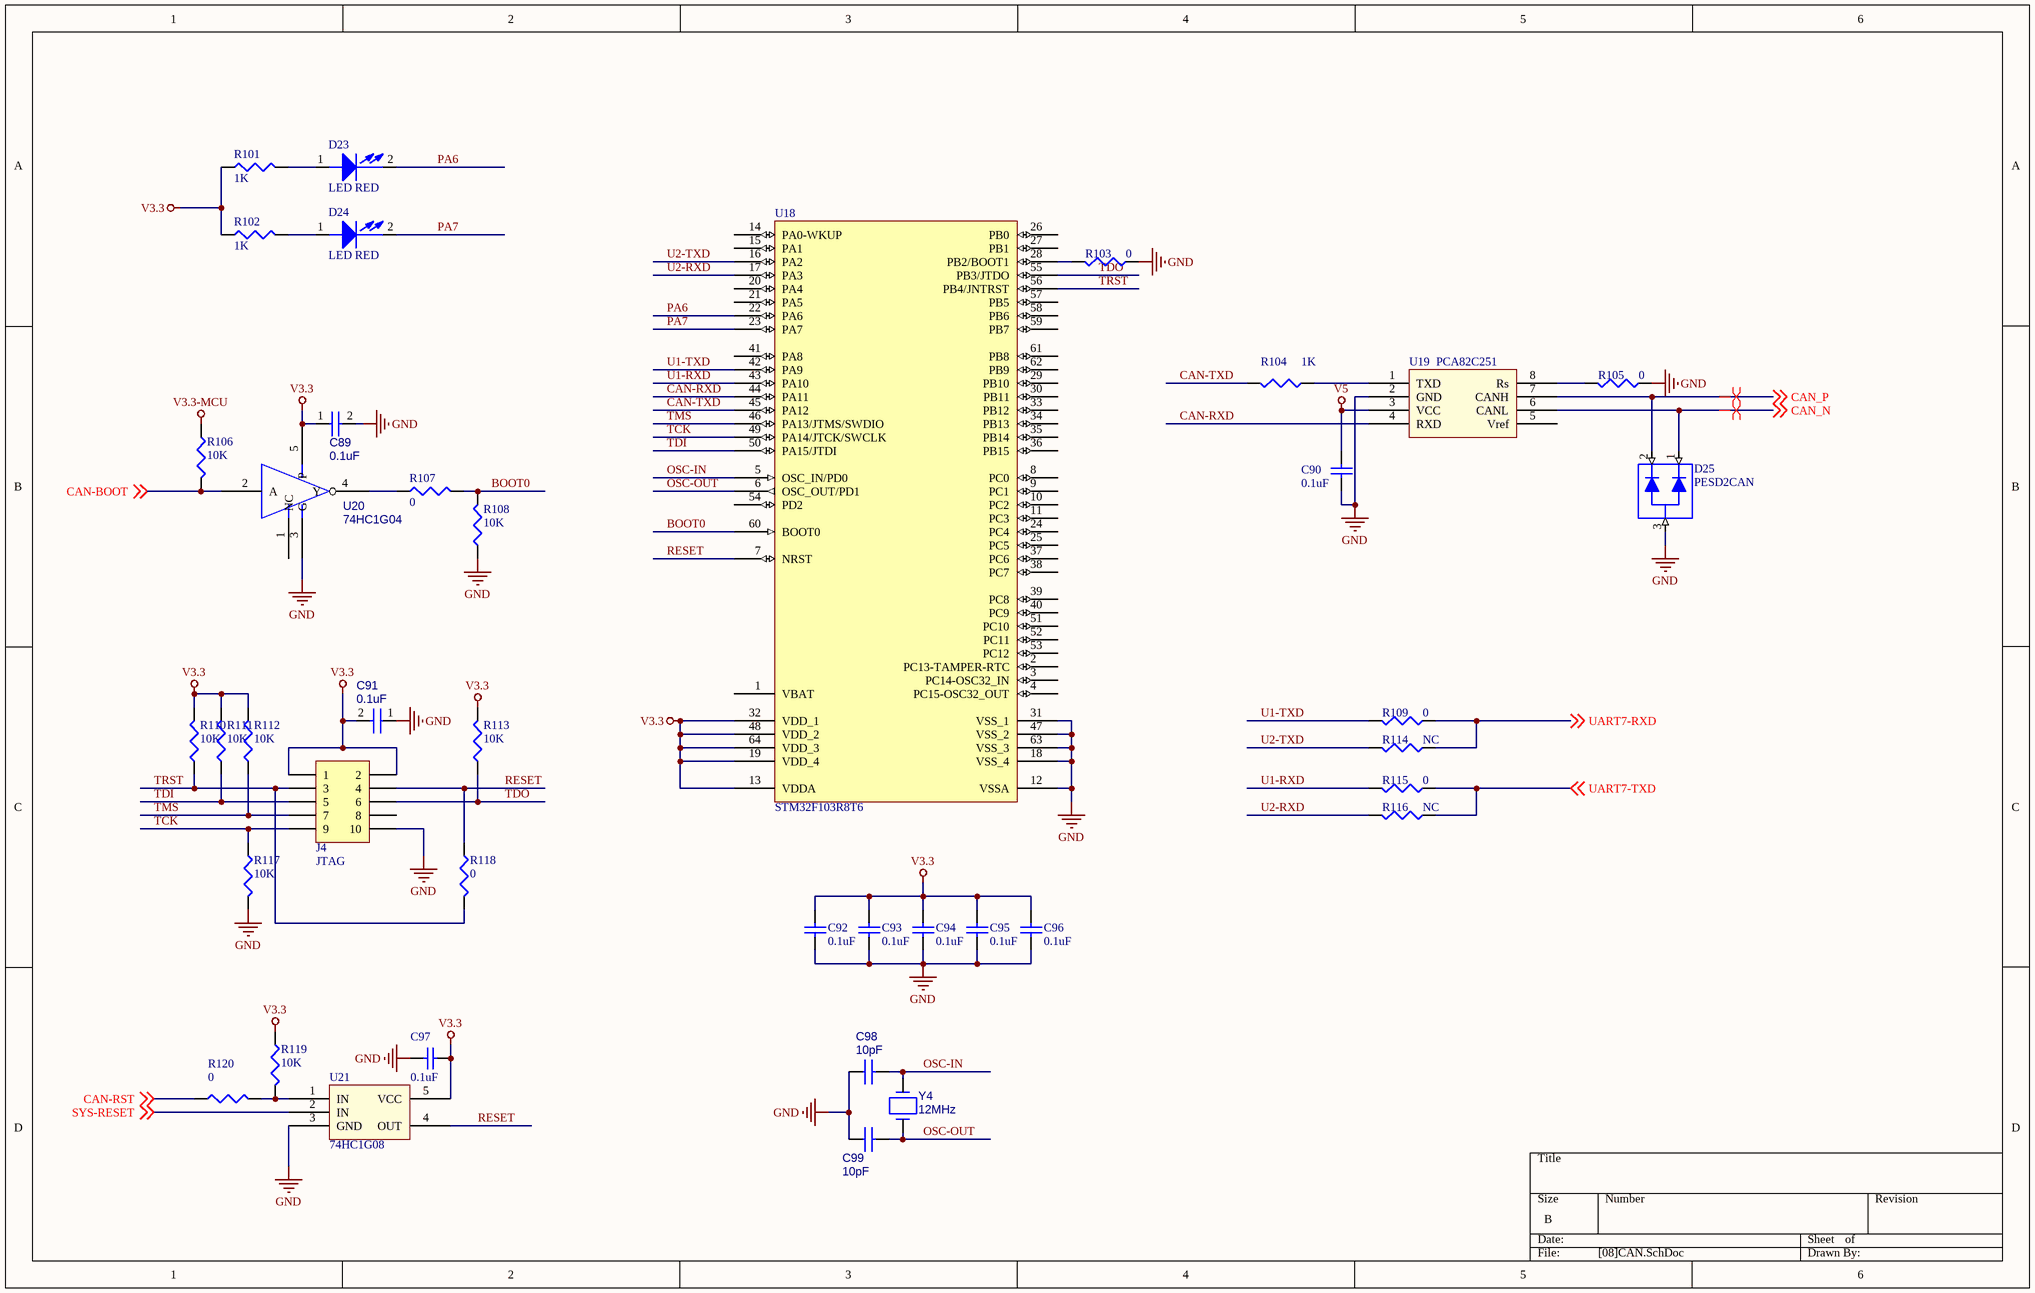
[diagram p7: [08]CAN.SchDoc]

### Parts
C89  0.1uF  [0603]
C90  0.1uF  [0603]
C91  0.1uF  [0603]
C92  0.1uF  [0603]
C93  0.1uF  [0603]
C94  0.1uF  [0603]
C95  0.1uF  [0603]
C96  0.1uF  [0603]
C97  0.1uF  [0603]
C98  10pF  [0603]
C99  10pF  [0603]
D23  LED RED  [LED0603]
D24  LED RED  [LED0603]
D25  PESD2CAN  [PESD2CAN]
J4  JTAG  [HDR2X5]
R101  1K  [0603]
R102  1K  [0603]
R103  0  [0603]
R104  1K  [0603]
R105  0  [0603]
R106  10K  [0603]
R107  0  [0603]
R108  10K  [0603]
R109  0  [0603]
R110  10K  [0603]
R111  10K  [0603]
R112  10K  [0603]
R113  10K  [0603]
R114  NC  [0603]
R115  0  [0603]
R116  NC  [0603]
R117  10K  [0603]
R118  0  [0603]
R119  10K  [0603]
R120  0  [0603]
U18  STM32F103R8T6  [LQFP64_N]
U19  PCA82C251  [SO8]
U20  74HC1G04  [SOT753]
U21  74HC1G08  [SOT23-5]
Y4  12MHz  [XTAL_SMD]

### Nets
GND: C89.2 C90.1 C91.1 C92.1 C93.1 C94.1 C95.1 C96.1 C97.2 C98.1 C99.1 D25.3 J4.10 R103.1 R105.1 R108.1 R117.2 U18.12(VSSA) U18.18(VSS_4) U18.31(VSS_1) U18.47(VSS_2) U18.63(VSS_3) U19.2(GND) U20.3(G) U21.3(GND)
V3.3: C89.1 C91.2 C92.2 C93.2 C94.2 C95.2 C96.2 C97.1 J4.1 J4.2 R101.1 R102.1 R110.2 R111.2 R112.2 R113.2 R119.1 U18.13(VDDA) U18.19(VDD_4) U18.32(VDD_1) U18.48(VDD_2) U18.64(VDD_3) U20.5(P) U21.5(VCC)
V3.3-MCU: R106.1
V5: C90.2 U19.3(VCC)
BOOT0: R107.2 R108.2 U18.60(BOOT0)
CAN-BOOT: R106.2 U20.2(A) ; off-sheet CAN-BOOT
CAN-RST: R120.1 ; off-sheet CAN-RST
CAN-RXD: U18.44(PA11) U19.4(RXD)
CAN-TXD: R104.2 U18.45(PA12)
CAN_N: D25.1 U19.6(CANL) ; off-sheet CAN_N
CAN_P: D25.2 U19.7(CANH) ; off-sheet CAN_P
OSC-IN: C98.2 U18.5(OSC_IN/PD0) Y4.2
OSC-OUT: C99.2 U18.6(OSC_OUT/PD1) Y4.1
PA6: D23.2(CATHODE) U18.22(PA6)
PA7: D24.2(CATHODE) U18.23(PA7)
RESET: J4.4 R118.1 U18.7(NRST) U21.4(OUT)
SYS-RESET: U21.2(IN) ; off-sheet SYS-RESET
TCK: J4.9 R117.1 U18.49(PA14/JTCK/SWCLK)
TDI: J4.5 R111.1 U18.50(PA15/JTDI)
TDO: J4.6 R113.1 U18.55(PB3/JTDO)
TMS: J4.7 R112.1 U18.46(PA13/JTMS/SWDIO)
TRST: J4.3 R110.1 R118.2 U18.56(PB4/JNTRST)
U1-RXD: R115.2 U18.43(PA10)
U1-TXD: R109.2 U18.42(PA9)
U2-RXD: R116.2 U18.17(PA3)
U2-TXD: R114.2 U18.16(PA2)
UART7-RXD: R109.1 R114.1 ; off-sheet UART7-RXD
UART7-TXD: R115.1 R116.1 ; off-sheet UART7-TXD
NetD23_1: D23.1(ANODE) R101.2
NetD24_1: D24.1(ANODE) R102.2
NetR103_2: R103.2 U18.28(PB2/BOOT1)
NetR104_1: R104.1 U19.1(TXD)
NetR105_2: R105.2 U19.8(Rs)
NetR107_1: R107.1 U20.4(Y)
NetR119_2: R119.2 R120.2 U21.1(IN)

Not connected (* = marked no-connect by the designer): J4 8; U18 1(VBAT) 2(PC13-TAMPER-RTC) 3(PC14-OSC32_IN) 4(PC15-OSC32_OUT) 8(PC0) 9(PC1) 10(PC2) 11(PC3) 14(PA0-WKUP) 15(PA1) 20(PA4) 21(PA5) 24(PC4) 25(PC5) 26(PB0) 27(PB1) 29(PB10) 30(PB11) 33(PB12) 34(PB13) 35(PB14) 36(PB15) 37(PC6) 38(PC7) 39(PC8) 40(PC9) 41(PA8) 51(PC10) 52(PC11) 53(PC12) 54(PD2) 57(PB5) 58(PB6) 59(PB7) 61(PB8) 62(PB9); U19 5(Vref); U20 1(NC)

### Layout directives
differential pair: CAN_N, CAN_P

### Library data of the parts
C89 C91 = CAP NP_Dup2
C90 C92-C97 = Cap: Capacitor
C98 C99 = CAP_Dup1
D23 D24 = LN01401_1
D25 = PESD2CAN: Part Number: SCA00000J00
J4 = Header 5X2: Header, 5-Pin, Dual row
R101 R102 R106 = CR16-1003FM
R103-R105 R107-R120 = Res3: Resistor
U18 = STM32F103R8T6: STM32 ARM-based 32-bit MCU with 64 Kbytes Flash, 64-pin LQFP, Industrial Temperature; Published: 30-May-2008; DatasheetVersion: rev6, Mar-2008; PackageVersion: Mar-2008; PackageReference: LQFP64; Publisher: Altium Limited; PackageDescription: 64-Pin Low-Profile Quad Flat Pack, 10 x 10 mm Body, 0.5 mm Pitch (LQFP64); ComponentLink1Description: Manufacturer Link; ComponentLink1URL: www.st.com/stm32; ComponentLink2Description: Datasheet; ComponentLink2URL: http://www.st.com/stonline/products/literature/ds/13587.pdf
U20 = 74LVC1G04GW_SOT353-5: Part  Number: SA00000FX00
Y4 = CRYSTAL

## Sheet [09]SERIAL_PORT.SchDoc
size B
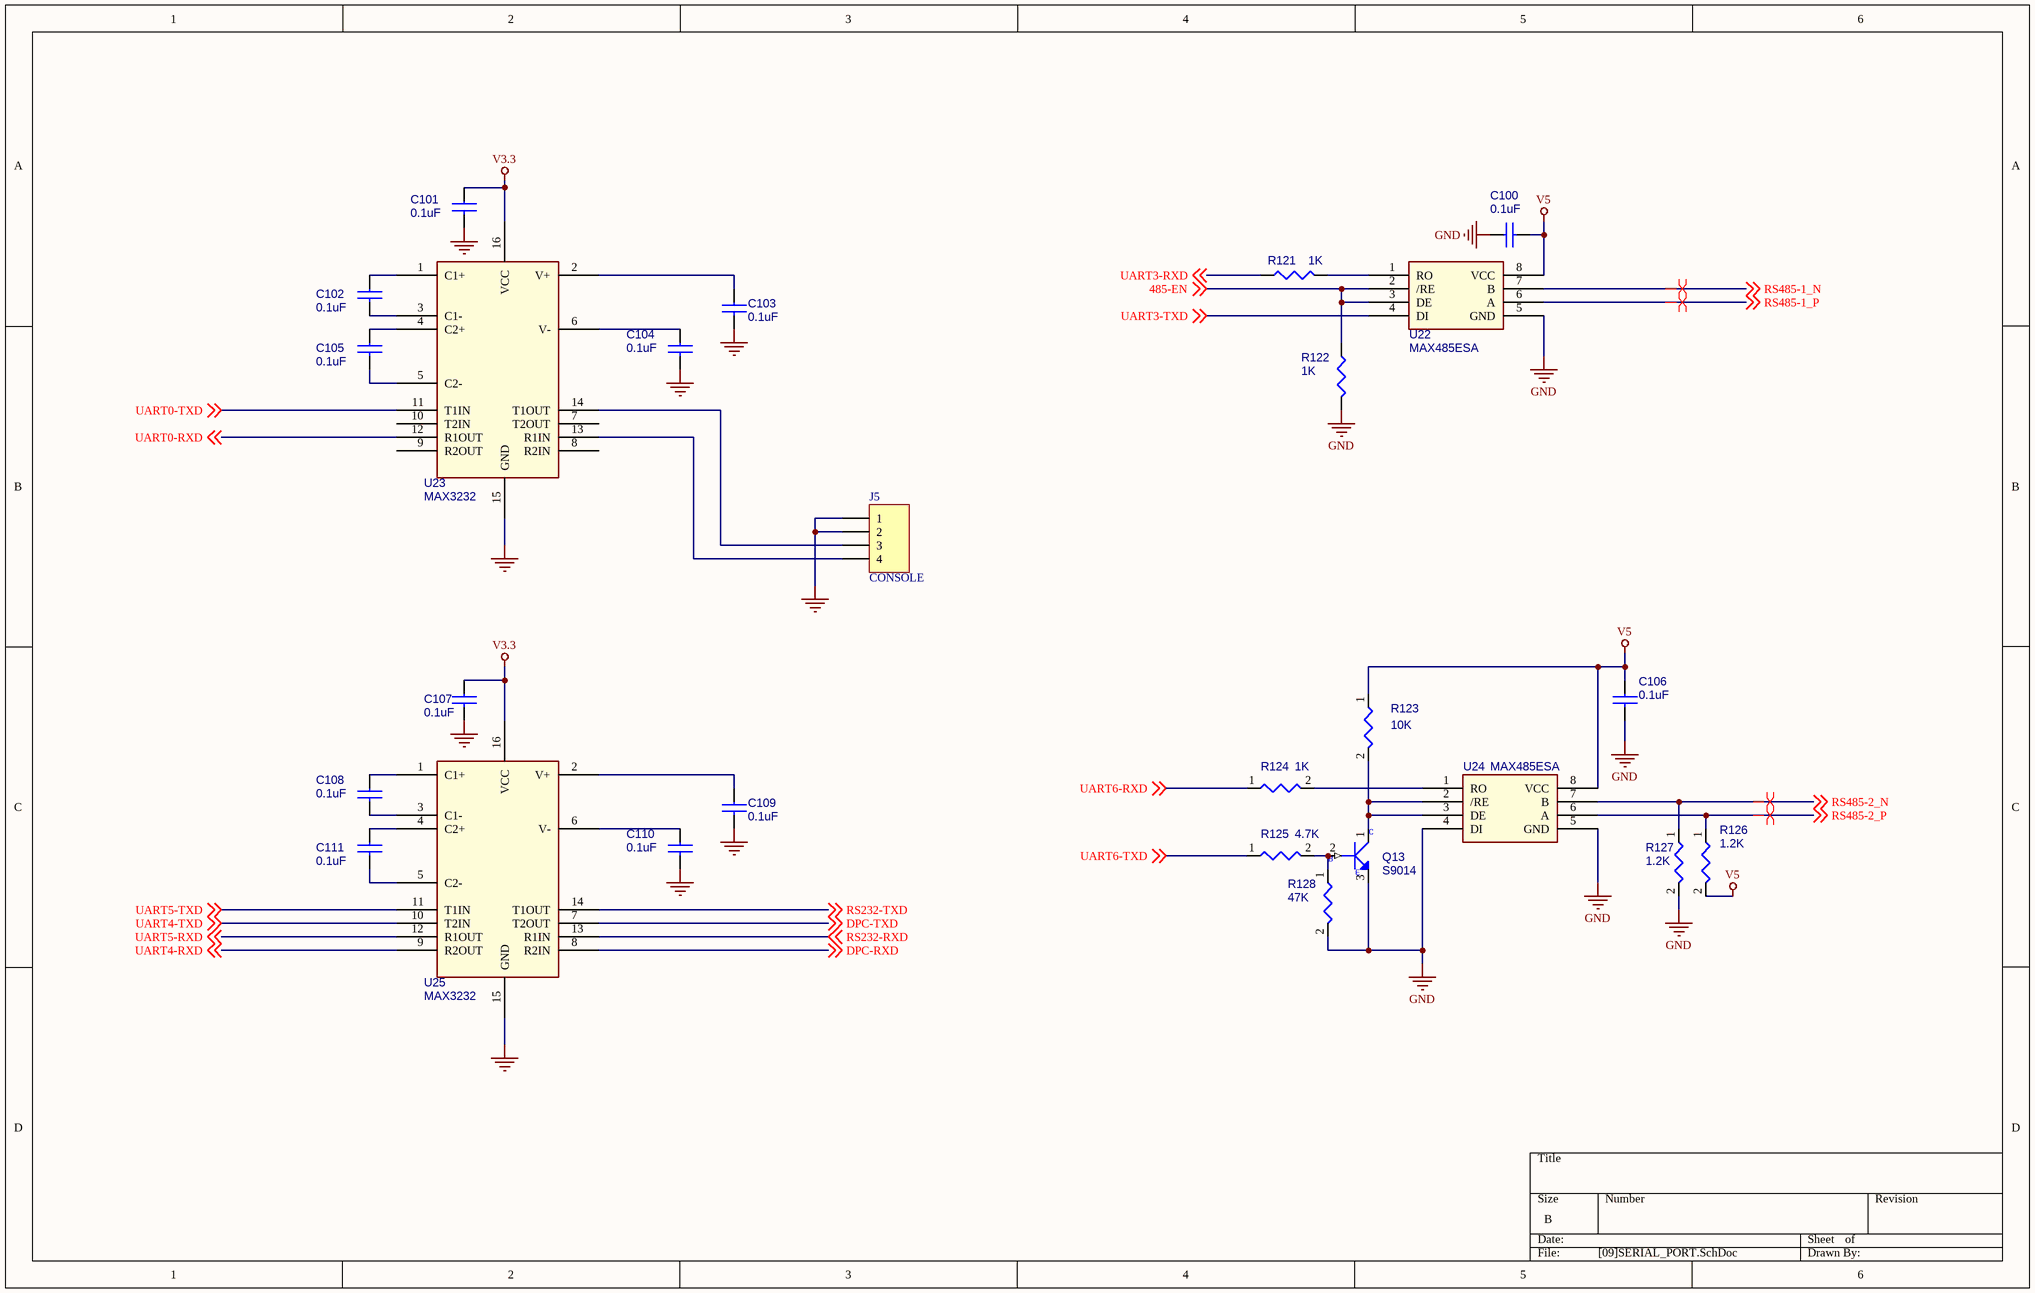
[diagram p8: [09]SERIAL_PORT.SchDoc]

### Parts
C100  0.1uF  [0603]
C101  0.1uF  [0603]
C102  0.1uF  [0603]
C103  0.1uF  [0603]
C104  0.1uF  [0603]
C105  0.1uF  [0603]
C106  0.1uF  [0603]
C107  0.1uF  [0603]
C108  0.1uF  [0603]
C109  0.1uF  [0603]
C110  0.1uF  [0603]
C111  0.1uF  [0603]
J5  CONSOLE  [HDR2X2H]
Q13  S9014  [NPN]
R121  1K  [0603]
R122  1K  [0603]
R123  10K  [0603]
R124  1K  [0603]
R125  4.7K  [0603]
R126  1.2K  [0603]
R127  1.2K  [0603]
R128  47K  [0603]
U22  MAX485ESA  [SO8]
U23  MAX3232  [SO-16]
U24  MAX485ESA  [SO8]
U25  MAX3232  [SO-16]

### Nets
GND: C100.1 C101.2 C103.2 C104.2 C106.2 C107.2 C109.2 C110.2 J5.1 J5.2 Q13.3(EMITTER) R122.2 R127.2 R128.2 U22.5(GND) U23.15(GND) U24.4(DI) U24.5(GND) U25.15(GND)
V3.3: C101.1 C107.1 U23.16(VCC) U25.16(VCC)
V5: C100.2 C106.1 R123.1 R126.2 U22.8(VCC) U24.8(VCC)
485-EN: R122.1 U22.2(/RE) U22.3(DE) ; off-sheet 485-EN
DPC-RXD: U25.8(R2IN) ; off-sheet DPC-RXD
DPC-TXD: U25.7(T2OUT) ; off-sheet DPC-TXD
RS232-RXD: U25.13(R1IN) ; off-sheet RS232-RXD
RS232-TXD: U25.14(T1OUT) ; off-sheet RS232-TXD
RS485-1_N: U22.7(B) ; off-sheet RS485-1_N
RS485-1_P: U22.6(A) ; off-sheet RS485-1_P
RS485-2_N: R127.1 U24.7(B) ; off-sheet RS485-2_N
RS485-2_P: R126.1 U24.6(A) ; off-sheet RS485-2_P
UART0-RXD: U23.12(R1OUT) ; off-sheet UART0-RXD
UART0-TXD: U23.11(T1IN) ; off-sheet UART0-TXD
UART3-RXD: R121.1 ; off-sheet UART3-RXD
UART3-TXD: U22.4(DI) ; off-sheet UART3-TXD
UART4-RXD: U25.9(R2OUT) ; off-sheet UART4-RXD
UART4-TXD: U25.10(T2IN) ; off-sheet UART4-TXD
UART5-RXD: U25.12(R1OUT) ; off-sheet UART5-RXD
UART5-TXD: U25.11(T1IN) ; off-sheet UART5-TXD
UART6-RXD: R124.1 ; off-sheet UART6-RXD
UART6-TXD: R125.1 ; off-sheet UART6-TXD
NetC102_1: C102.1 U23.1(C1+)
NetC102_2: C102.2 U23.3(C1-)
NetC103_1: C103.1 U23.2(V+)
NetC104_1: C104.1 U23.6(V-)
NetC105_1: C105.1 U23.4(C2+)
NetC105_2: C105.2 U23.5(C2-)
NetC108_1: C108.1 U25.1(C1+)
NetC108_2: C108.2 U25.3(C1-)
NetC109_1: C109.1 U25.2(V+)
NetC110_1: C110.1 U25.6(V-)
NetC111_1: C111.1 U25.4(C2+)
NetC111_2: C111.2 U25.5(C2-)
NetJ5_3: J5.3 U23.14(T1OUT)
NetJ5_4: J5.4 U23.13(R1IN)
NetQ13_1: Q13.1(COLLECTOR) R123.2 U24.2(/RE) U24.3(DE)
NetQ13_2: Q13.2(BASE) R125.2 R128.1
NetR121_2: R121.2 U22.1(RO)
NetR124_2: R124.2 U24.1(RO)

Not connected (* = marked no-connect by the designer): U23 7(T2OUT) 8(R2IN) 9(R2OUT) 10(T2IN)

### Layout directives
differential pair: RS485-1_N, RS485-1_P, RS485-2_N, RS485-2_P

### Notes on the sheet
- (in symbol MMBT3904_NL_SOT23-3) C; B; E

### Library data of the parts
C100 = P_CAP NP: Part Number: SE132225K8L; Part Description: S CER CAP 2.2U 10V K X5R 0603; Function Field: 41.5; Ecology: YES; ROOM: GPS; AP: AP; Part Type: CAPACITOR; Approved Date: 6/27/2006; Lead Free: MY
C101-C111 = CAP
J5 = Header 4: Header, 4-Pin
Q13 = MMBT3904_NL_SOT23-3: as Q2 on sheet [01]POWER
R121-R124 R126 R127 = R: Manufacturer Part number: null; Part Description: S RES 1/16W 10K +-5% 0402; Part Number: SD02810028L; ROOM: SD; Deletion Flag: 0; Function Field: 32.3; Ecology: YES; Part Type: RESISTOR; AP Sheet: http://ISPDPRD/Windchill/servlet/WindchillAuthGW/wt.enterprise.URLProcessor/URLTemplateAction?u8&oid=VR%3Aext.compal.part.Comp; AP: AP; Lead Free: Y1
R125 R128 = R: Part Number: SD02810028L; Part Description: S RES 1/16W 10K +-5% 0402; Manufacturer Part number: null; Ecology: YES; Function Field: 32.3; Deletion Flag: 0; ROOM: SD; Lead Free: Y1; AP: AP; AP Sheet: http://ISPDPRD/Windchill/servlet/WindchillAuthGW/wt.enterprise.URLProcessor/URLTemplateAction?u8&oid=VR%3Aext.compal.part.Comp; Part Type: RESISTOR
U22 U24 = MAX485

## Sheet [10]MISC.SchDoc
size A4
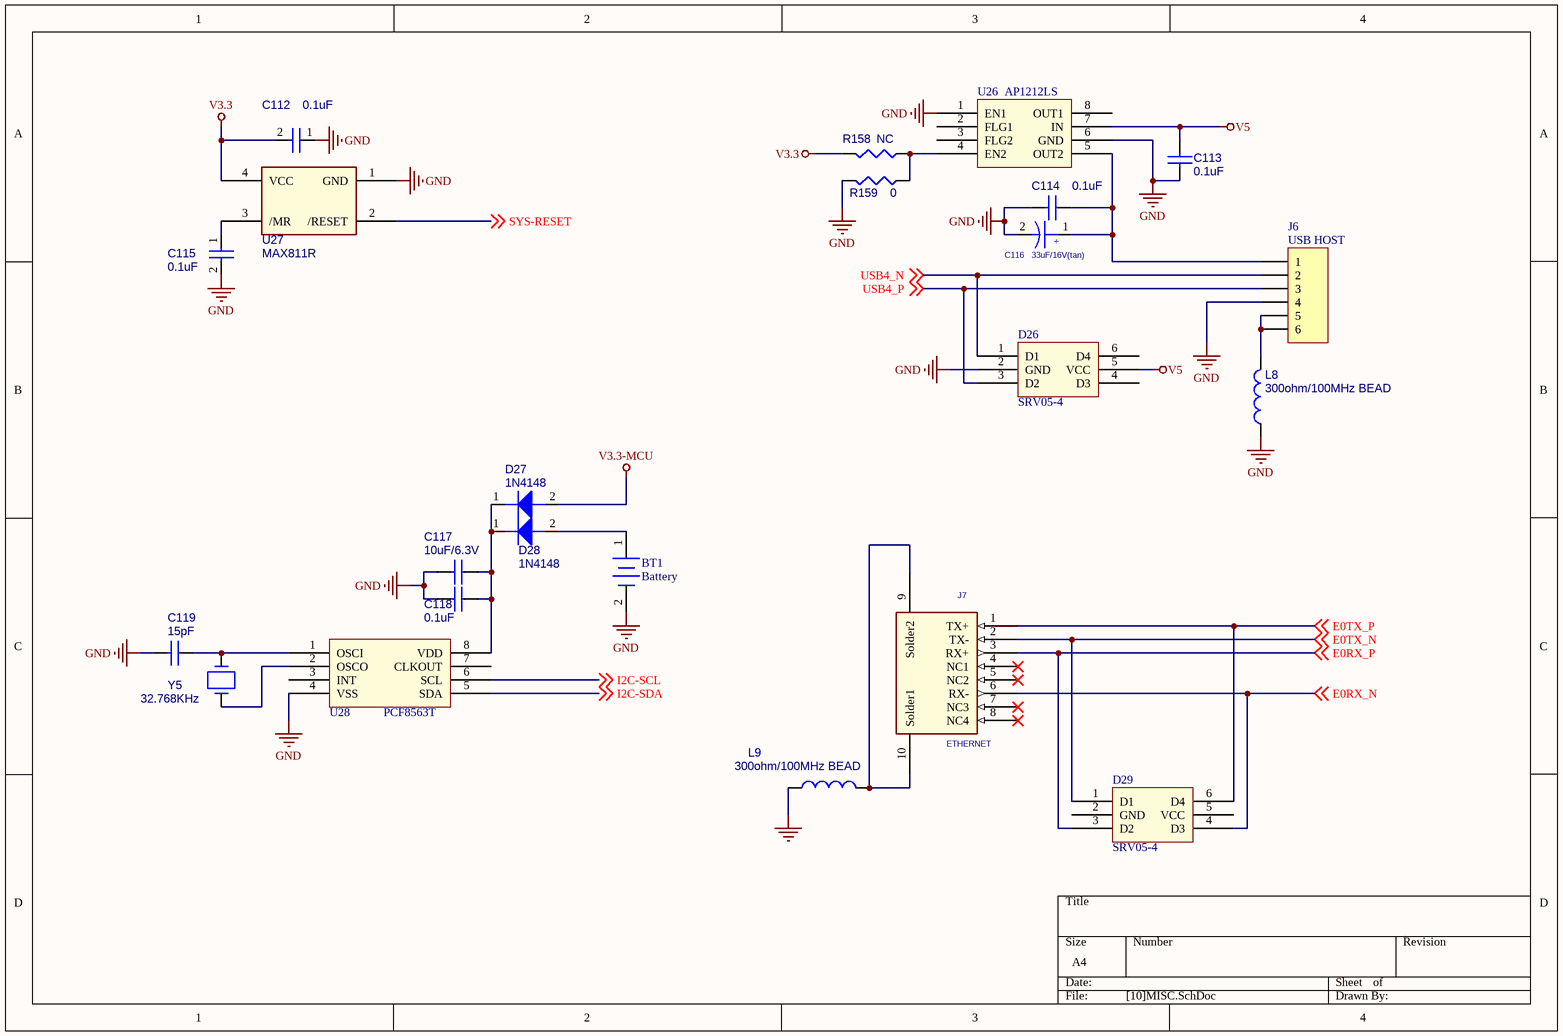
[diagram p9: [10]MISC.SchDoc]

### Parts
BT1  Battery  [CR1220]
C112  0.1uF  [0603]
C113  0.1uF  [0603]
C114  0.1uF  [0603]
C115  0.1uF  [0603]
C116  33uF/16V(tan)  [3528]
C117  10uF/6.3V  [0805]
C118  0.1uF  [0603]
C119  15pF  [0603]
D26  SRV05-4  [SOT23-6]
D27  1N4148  [MINI-MELF]
D28  1N4148  [MINI-MELF]
D29  SRV05-4  [SOT23-6]
J6  USB HOST  [USB-HOST]
J7  ETHERNET  [RJ45]
L8  300ohm/100MHz BEAD  [0603]
L9  300ohm/100MHz BEAD  [0603]
R158  NC  [0603]
R159  0  [0603]
U26  AP1212LS  [SO8]
U27  MAX811R  [SOT143]
U28  PCF8563T  [SO8]
Y5  32.768KHz  [XTAL]

### Nets
GND: BT1.2(-) C112.1 C113.2 C114.2 C115.2 C116.2 C117.2 C118.2 C119.2 D26.2(GND) J6.4 L8.2 L9.2 R159.2 U26.1(EN1) U26.6(GND) U27.1(GND) U28.4(VSS)
V3.3: C112.2 R158.2 U27.4(VCC)
V3.3-MCU: D27.2
V5: C113.1 D26.5(VCC) U26.7(IN)
E0RX_N: D29.4(D3) J7.6(RX-) ; off-sheet E0RX_N
E0RX_P: D29.3(D2) J7.3(RX+) ; off-sheet E0RX_P
E0TX_N: D29.1(D1) J7.2(TX-) ; off-sheet E0TX_N
E0TX_P: D29.6(D4) J7.1(TX+) ; off-sheet E0TX_P
I2C-SCL: U28.6(SCL) ; off-sheet I2C-SCL
I2C-SDA: U28.5(SDA) ; off-sheet I2C-SDA
SYS-RESET: U27.2(/RESET) ; off-sheet SYS-RESET
USB4_N: D26.1(D1) J6.2 ; off-sheet USB4_N
USB4_P: D26.3(D2) J6.3 ; off-sheet USB4_P
NetBT1_1: BT1.1(+) D28.2
NetC114_1: C114.1 C116.1 J6.1 U26.5(OUT2)
NetC115_1: C115.1 U27.3(/MR)
NetC117_1: C117.1 C118.1 D27.1 D28.1 U28.8(VDD)
NetC119_1: C119.1 U28.1(OSCI) Y5.2
NetJ6_5: J6.5 J6.6 L8.1
NetJ7_9: J7.9(Solder2) J7.10(Solder1) L9.1
NetR158_1: R158.1 R159.1 U26.4(EN2)
NetU28_2: U28.2(OSCO) Y5.1

Not connected (* = marked no-connect by the designer): D26 4(D3) 6(D4); D29 2(GND) 5(VCC); J7 4(NC1)* 5(NC2)* 7(NC3)* 8(NC4)*; U26 2(FLG1) 3(FLG2) 8(OUT1); U28 3(INT) 7(CLKOUT)

### Notes on the sheet
- (in symbol CAP WP) +

### Library data of the parts
BT1 = Battery: Multicell Battery
C112 C115 = CAP NP_Dup2
C113 C114 C117-C119 = CAP_Dup1
C116 = CAP WP
D27 D28 = 1N4148WS-7-F_SOD323-2
J6 = Header 6: Header, 6-Pin
J7 = NET
L8 L9 = INDUCTOR_4
R158 = R: as R125 on sheet [09]SERIAL_PORT; Lead Free: Y1; AP: AP; AP Sheet: http://ISPDPRD/Windchill/servlet/WindchillAuthGW/wt.enterprise.URLProcessor/URLTemplateAction?u8&oid=VR%3Aext.compal.part.Comp; Part Type: RESISTOR
R159 = R: Part Number: SD02810028L; Part Description: S RES 1/16W 10K +-5% 0402; Manufacturer Part number: null; Ecology: YES; Function Field: 32.3; ROOM: SD; Lead Free: Y1; AP: AP; AP Sheet: http://ISPDPRD/Windchill/servlet/WindchillAuthGW/wt.enterprise.URLProcessor/URLTemplateAction?u8&oid=VR%3Aext.compal.part.Comp; Part Type: RESISTOR; Deletion Flag: 0
U26 = AP1212
U27 = MAX811
Y5 = CRYSTAL

## Sheet [11]VIDEO_PORT.SchDoc
size B
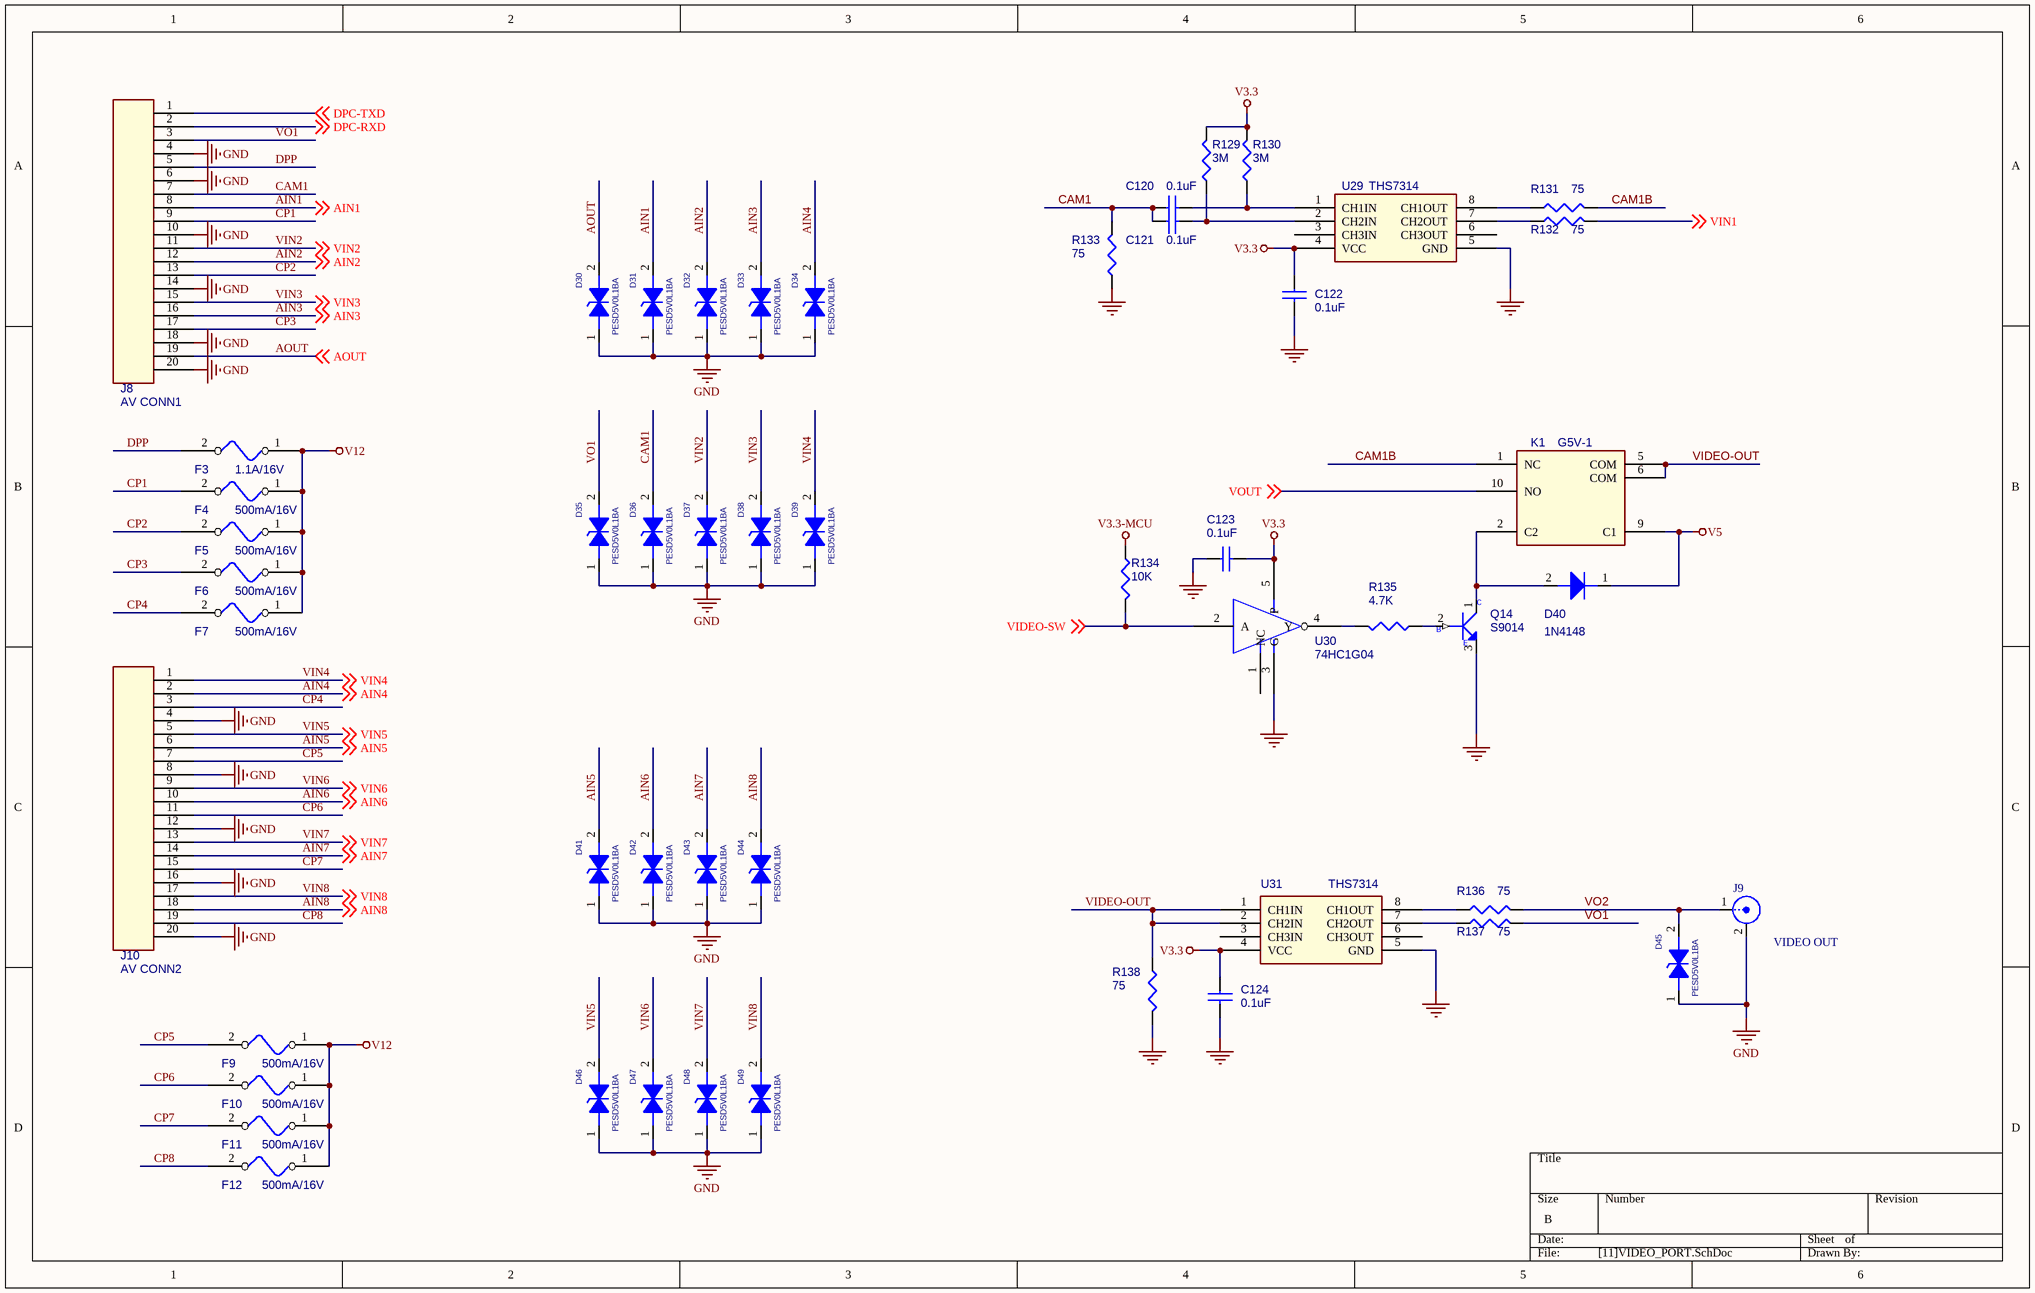
[diagram p10: [11]VIDEO_PORT.SchDoc]

### Parts
C120  0.1uF  [0603]
C121  0.1uF  [0603]
C122  0.1uF  [0603]
C123  0.1uF  [0603]
C124  0.1uF  [0603]
D30  PESD5V0L1BA  [SOD323]
D31  PESD5V0L1BA  [SOD323]
D32  PESD5V0L1BA  [SOD323]
D33  PESD5V0L1BA  [SOD323]
D34  PESD5V0L1BA  [SOD323]
D35  PESD5V0L1BA  [SOD323]
D36  PESD5V0L1BA  [SOD323]
D37  PESD5V0L1BA  [SOD323]
D38  PESD5V0L1BA  [SOD323]
D39  PESD5V0L1BA  [SOD323]
D40  1N4148  [MINI-MELF]
D41  PESD5V0L1BA  [SOD323]
D42  PESD5V0L1BA  [SOD323]
D43  PESD5V0L1BA  [SOD323]
D44  PESD5V0L1BA  [SOD323]
D45  PESD5V0L1BA  [SOD323]
D46  PESD5V0L1BA  [SOD323]
D47  PESD5V0L1BA  [SOD323]
D48  PESD5V0L1BA  [SOD323]
D49  PESD5V0L1BA  [SOD323]
F3  1.1A/16V  [1812]
F4  500mA/16V  [1812]
F5  500mA/16V  [1812]
F6  500mA/16V  [1812]
F7  500mA/16V  [1812]
F9  500mA/16V  [1812]
F10  500mA/16V  [1812]
F11  500mA/16V  [1812]
F12  500mA/16V  [1812]
J8  AV CONN1  [CONN2X10]
J9  VIDEO OUT  [RCA2]
J10  AV CONN2  [CONN2X10]
K1  G5V-1  [G5V-1]
Q14  S9014  [NPN]
R129  3M  [0603]
R130  3M  [0603]
R131  75  [0603]
R132  75  [0603]
R133  75  [0603]
R134  10K  [0603]
R135  4.7K  [0603]
R136  75  [0603]
R137  75  [0603]
R138  75  [0603]
U29  THS7314  [so8]
U30  74HC1G04  [SOT753]
U31  THS7314  [so8]

### Nets
GND: C122.2 C123.1 C124.2 D30.1 D31.1 D32.1 D33.1 D34.1 D35.1 D36.1 D37.1 D38.1 D39.1 D41.1 D42.1 D43.1 D44.1 D45.1 D46.1 D47.1 D48.1 D49.1 J8.4 J8.6 J8.10 J8.14 J8.18 J8.20 J9.2(Y) J10.4 J10.8 J10.12 J10.16 J10.20 Q14.3(EMITTER) R133.1 R138.2 U29.5(GND) U30.3(G) U31.5(GND)
V3.3: C122.1 C123.2 C124.1 R129.2 R130.2 U29.4(VCC) U30.5(P) U31.4(VCC)
V3.3-MCU: R134.1
V5: D40.1 K1.9(C1)
V12: F3.1 F4.1 F5.1 F6.1 F7.1 F9.1 F10.1 F11.1 F12.1
AIN1: D31.2 J8.8 ; off-sheet AIN1
AIN2: D32.2 J8.12 ; off-sheet AIN2
AIN3: D33.2 J8.16 ; off-sheet AIN3
AIN4: D34.2 J10.2 ; off-sheet AIN4
AIN5: D41.2 J10.6 ; off-sheet AIN5
AIN6: D42.2 J10.10 ; off-sheet AIN6
AIN7: D43.2 J10.14 ; off-sheet AIN7
AIN8: D44.2 J10.18 ; off-sheet AIN8
AOUT: D30.2 J8.19 ; off-sheet AOUT
CAM1: C120.1 C121.1 D36.2 J8.7 R133.2
CAM1B: K1.1(NC) R131.2
CP1: F4.2 J8.9
CP2: F5.2 J8.13
CP3: F6.2 J8.17
CP4: F7.2 J10.3
CP5: F9.2 J10.7
CP6: F10.2 J10.11
CP7: F11.2 J10.15
CP8: F12.2 J10.19
DPC-RXD: J8.2 ; off-sheet DPC-RXD
DPC-TXD: J8.1 ; off-sheet DPC-TXD
DPP: F3.2 J8.5
VIDEO-OUT: K1.5(COM) K1.6(COM) R138.1 U31.1(CH1IN) U31.2(CH2IN)
VIDEO-SW: R134.2 U30.2(A) ; off-sheet VIDEO-SW
VIN1: R132.2 ; off-sheet VIN1
VIN2: D37.2 J8.11 ; off-sheet VIN2
VIN3: D38.2 J8.15 ; off-sheet VIN3
VIN4: D39.2 J10.1 ; off-sheet VIN4
VIN5: D46.2 J10.5 ; off-sheet VIN5
VIN6: D47.2 J10.9 ; off-sheet VIN6
VIN7: D48.2 J10.13 ; off-sheet VIN7
VIN8: D49.2 J10.17 ; off-sheet VIN8
VO1: D35.2 J8.3 R137.2
VO2: D45.2 J9.1(X) R136.2
VOUT: K1.10(NO) ; off-sheet VOUT
NetC120_2: C120.2 R130.1 U29.1(CH1IN)
NetC121_2: C121.2 R129.1 U29.2(CH2IN)
NetD40_2: D40.2 K1.2(C2) Q14.1(COLLECTOR)
NetQ14_2: Q14.2(BASE) R135.1
NetR131_1: R131.1 U29.8(CH1OUT)
NetR132_1: R132.1 U29.7(CH2OUT)
NetR135_2: R135.2 U30.4(Y)
NetR136_1: R136.1 U31.8(CH1OUT)
NetR137_1: R137.1 U31.7(CH2OUT)

Not connected (* = marked no-connect by the designer): U29 3(CH3IN) 6(CH3OUT); U30 1(NC); U31 3(CH3IN) 6(CH3OUT)

### Notes on the sheet
- (in symbol MMBT3904_NL_SOT23-3) C; B; E

### Library data of the parts
C120-C122 C124 = CAP
C123 = P_CAP NP: as C100 on sheet [09]SERIAL_PORT; AP: AP; Part Type: CAPACITOR; Approved Date: 6/27/2006; Lead Free: MY
D30-D39 D41-D49 = PESD
D40 = 1N4148WS-7-F_SOD323-2
F3-F7 F9-F12 = 2A_32VDC_0467-002
J8 J10 = CON20
J9 = BNC: BNC Elbow Connector; LatestRevisionDate: 17-Jul-2002; LatestRevisionNote: Re-released for DXP Platform.; Publisher: Altium Limited
K1 = G5V-1_0
Q14 = MMBT3904_NL_SOT23-3: as Q2 on sheet [01]POWER
R129-R133 R136-R138 = R: as R121 on sheet [09]SERIAL_PORT; Part Type: RESISTOR; AP Sheet: http://ISPDPRD/Windchill/servlet/WindchillAuthGW/wt.enterprise.URLProcessor/URLTemplateAction?u8&oid=VR%3Aext.compal.part.Comp; AP: AP; Lead Free: Y1
R134 R135 = R: as R125 on sheet [09]SERIAL_PORT; Lead Free: Y1; AP: AP; AP Sheet: http://ISPDPRD/Windchill/servlet/WindchillAuthGW/wt.enterprise.URLProcessor/URLTemplateAction?u8&oid=VR%3Aext.compal.part.Comp; Part Type: RESISTOR
U30 = 74LVC1G04GW_SOT353-5: Part  Number: SA00000FX00

## Sheet [12]IO_PORT.SchDoc
size A4
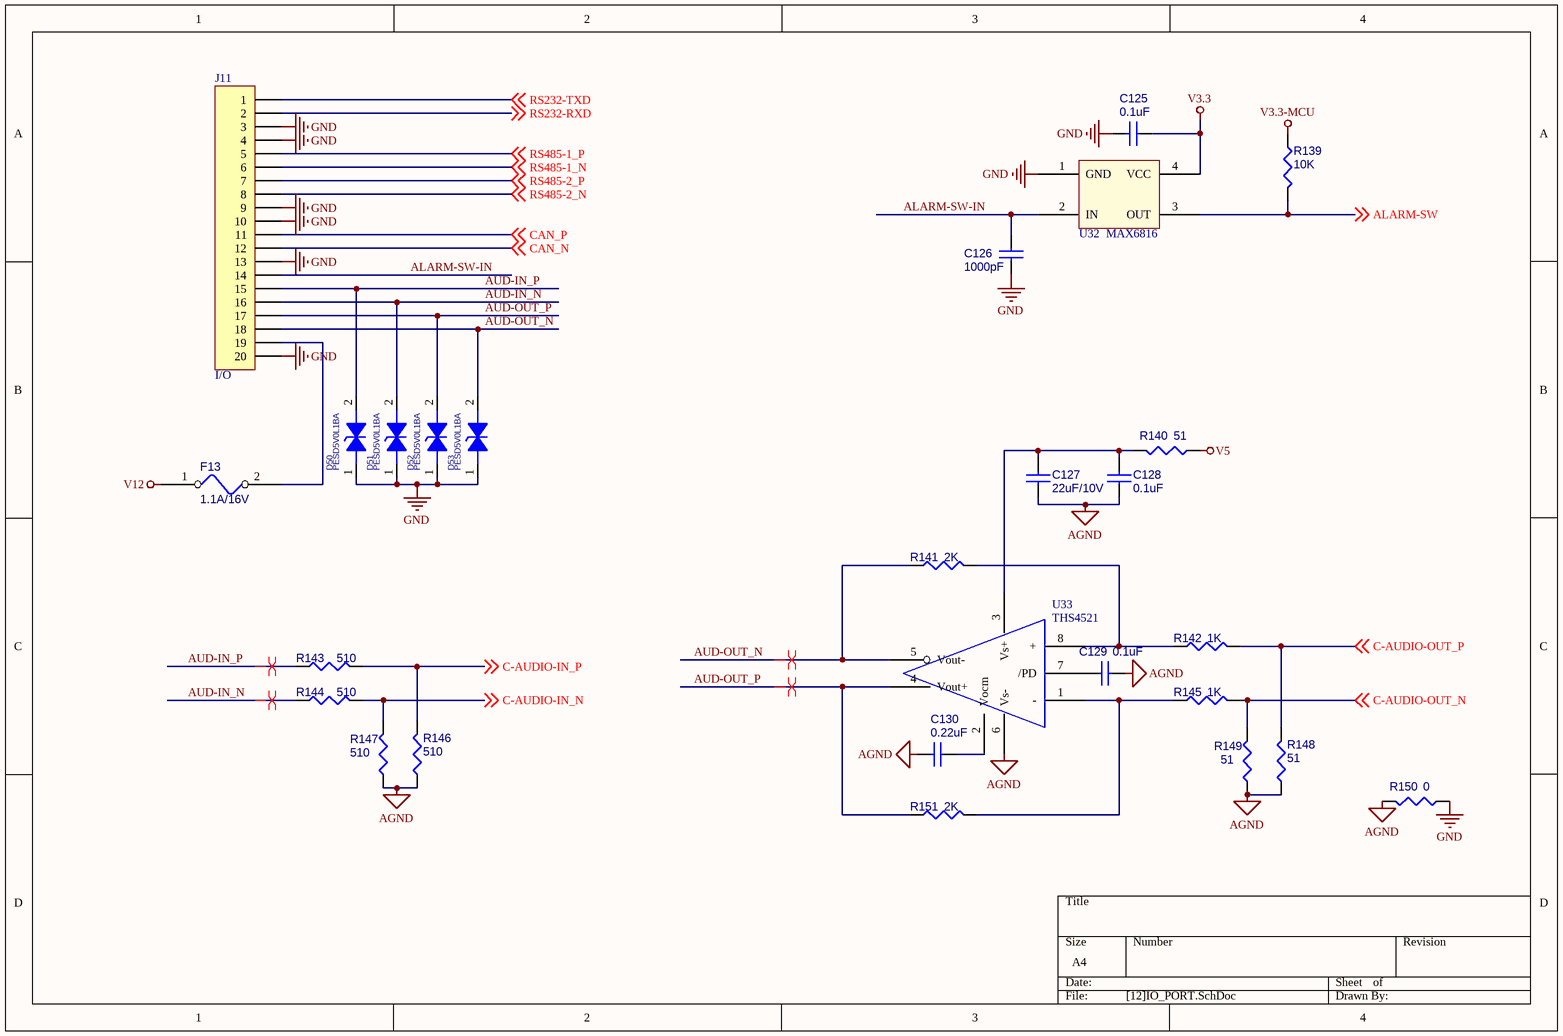
[diagram p11: [12]IO_PORT.SchDoc]

### Parts
C125  0.1uF  [0603]
C126  1000pF  [0603]
C127  22uF/10V  [1210]
C128  0.1uF  [0603]
C129  0.1uF  [0603]
C130  0.22uF  [0603]
D50  PESD5V0L1BA  [SOD323]
D51  PESD5V0L1BA  [SOD323]
D52  PESD5V0L1BA  [SOD323]
D53  PESD5V0L1BA  [SOD323]
F13  1.1A/16V  [1812]
J11  I/O  [COMM-3MM-2X10]
R139  10K  [0603]
R140  51  [0603]
R141  2K  [0603]
R142  1K  [0603]
R143  510  [0603]
R144  510  [0603]
R145  1K  [0603]
R146  510  [0603]
R147  510  [0603]
R148  51  [0603]
R149  51  [0603]
R150  0  [0603]
R151  2K  [0603]
U32  MAX6816  [SOT143]
U33  THS4521  [SO8]

### Nets
AGND: C127.1 C128.1 C129.2 C130.2 R146.2 R147.2 R148.2 R149.2 R150.1 U33.6(Vs-)
GND: C125.2 C126.2 D50.1 D51.1 D52.1 D53.1 J11.3 J11.4 J11.9 J11.10 J11.13 J11.20 R150.2 U32.1(GND)
V3.3: C125.1 U32.4(VCC)
V3.3-MCU: R139.1
V5: R140.2
V12: F13.1
ALARM-SW: R139.2 U32.3(OUT) ; off-sheet ALARM-SW
ALARM-SW-IN: C126.1 J11.14 U32.2(IN)
AUD-IN_N: D51.2 J11.16 R144.2
AUD-IN_P: D50.2 J11.15 R143.2
AUD-OUT_N: D53.2 J11.18 R141.2 U33.5(Vout-)
AUD-OUT_P: D52.2 J11.17 R151.2 U33.4(Vout+)
C-AUDIO-IN_N: R144.1 R147.1 ; off-sheet C-AUDIO-IN_N
C-AUDIO-IN_P: R143.1 R146.1 ; off-sheet C-AUDIO-IN_P
C-AUDIO-OUT_N: R145.1 R149.1 ; off-sheet C-AUDIO-OUT_N
C-AUDIO-OUT_P: R142.1 R148.1 ; off-sheet C-AUDIO-OUT_P
CAN_N: J11.12 ; off-sheet CAN_N
CAN_P: J11.11 ; off-sheet CAN_P
RS232-RXD: J11.2 ; off-sheet RS232-RXD
RS232-TXD: J11.1 ; off-sheet RS232-TXD
RS485-1_N: J11.6 ; off-sheet RS485-1_N
RS485-1_P: J11.5 ; off-sheet RS485-1_P
RS485-2_N: J11.8 ; off-sheet RS485-2_N
RS485-2_P: J11.7 ; off-sheet RS485-2_P
NetC127_2: C127.2 C128.2 R140.1 U33.3(Vs+)
NetC129_1: C129.1 U33.7(/PD)
NetC130_1: C130.1 U33.2(Vocm)
NetF13_2: F13.2 J11.19
NetR141_1: R141.1 R142.2 U33.8(+)
NetR145_2: R145.2 R151.1 U33.1(-)

### Layout directives
differential pair: AUD-IN_N, AUD-IN_P, AUD-OUT_N, AUD-OUT_P

### Library data of the parts
C125 C126 = CAP
C127-C130 = P_CAP NP
D50-D53 = PESD
F13 = 2A_32VDC_0467-002
J11 = Header 20: Header, 20-Pin; LatestRevisionDate: 17-Jul-2002; LatestRevisionNote: Re-released for DXP Platform.; Publisher: Altium Limited
R139 = R
R140-R151 = P_R